# Altium project SAMD21_Xplained_Pro.PrjPCB (part 1 of 2)
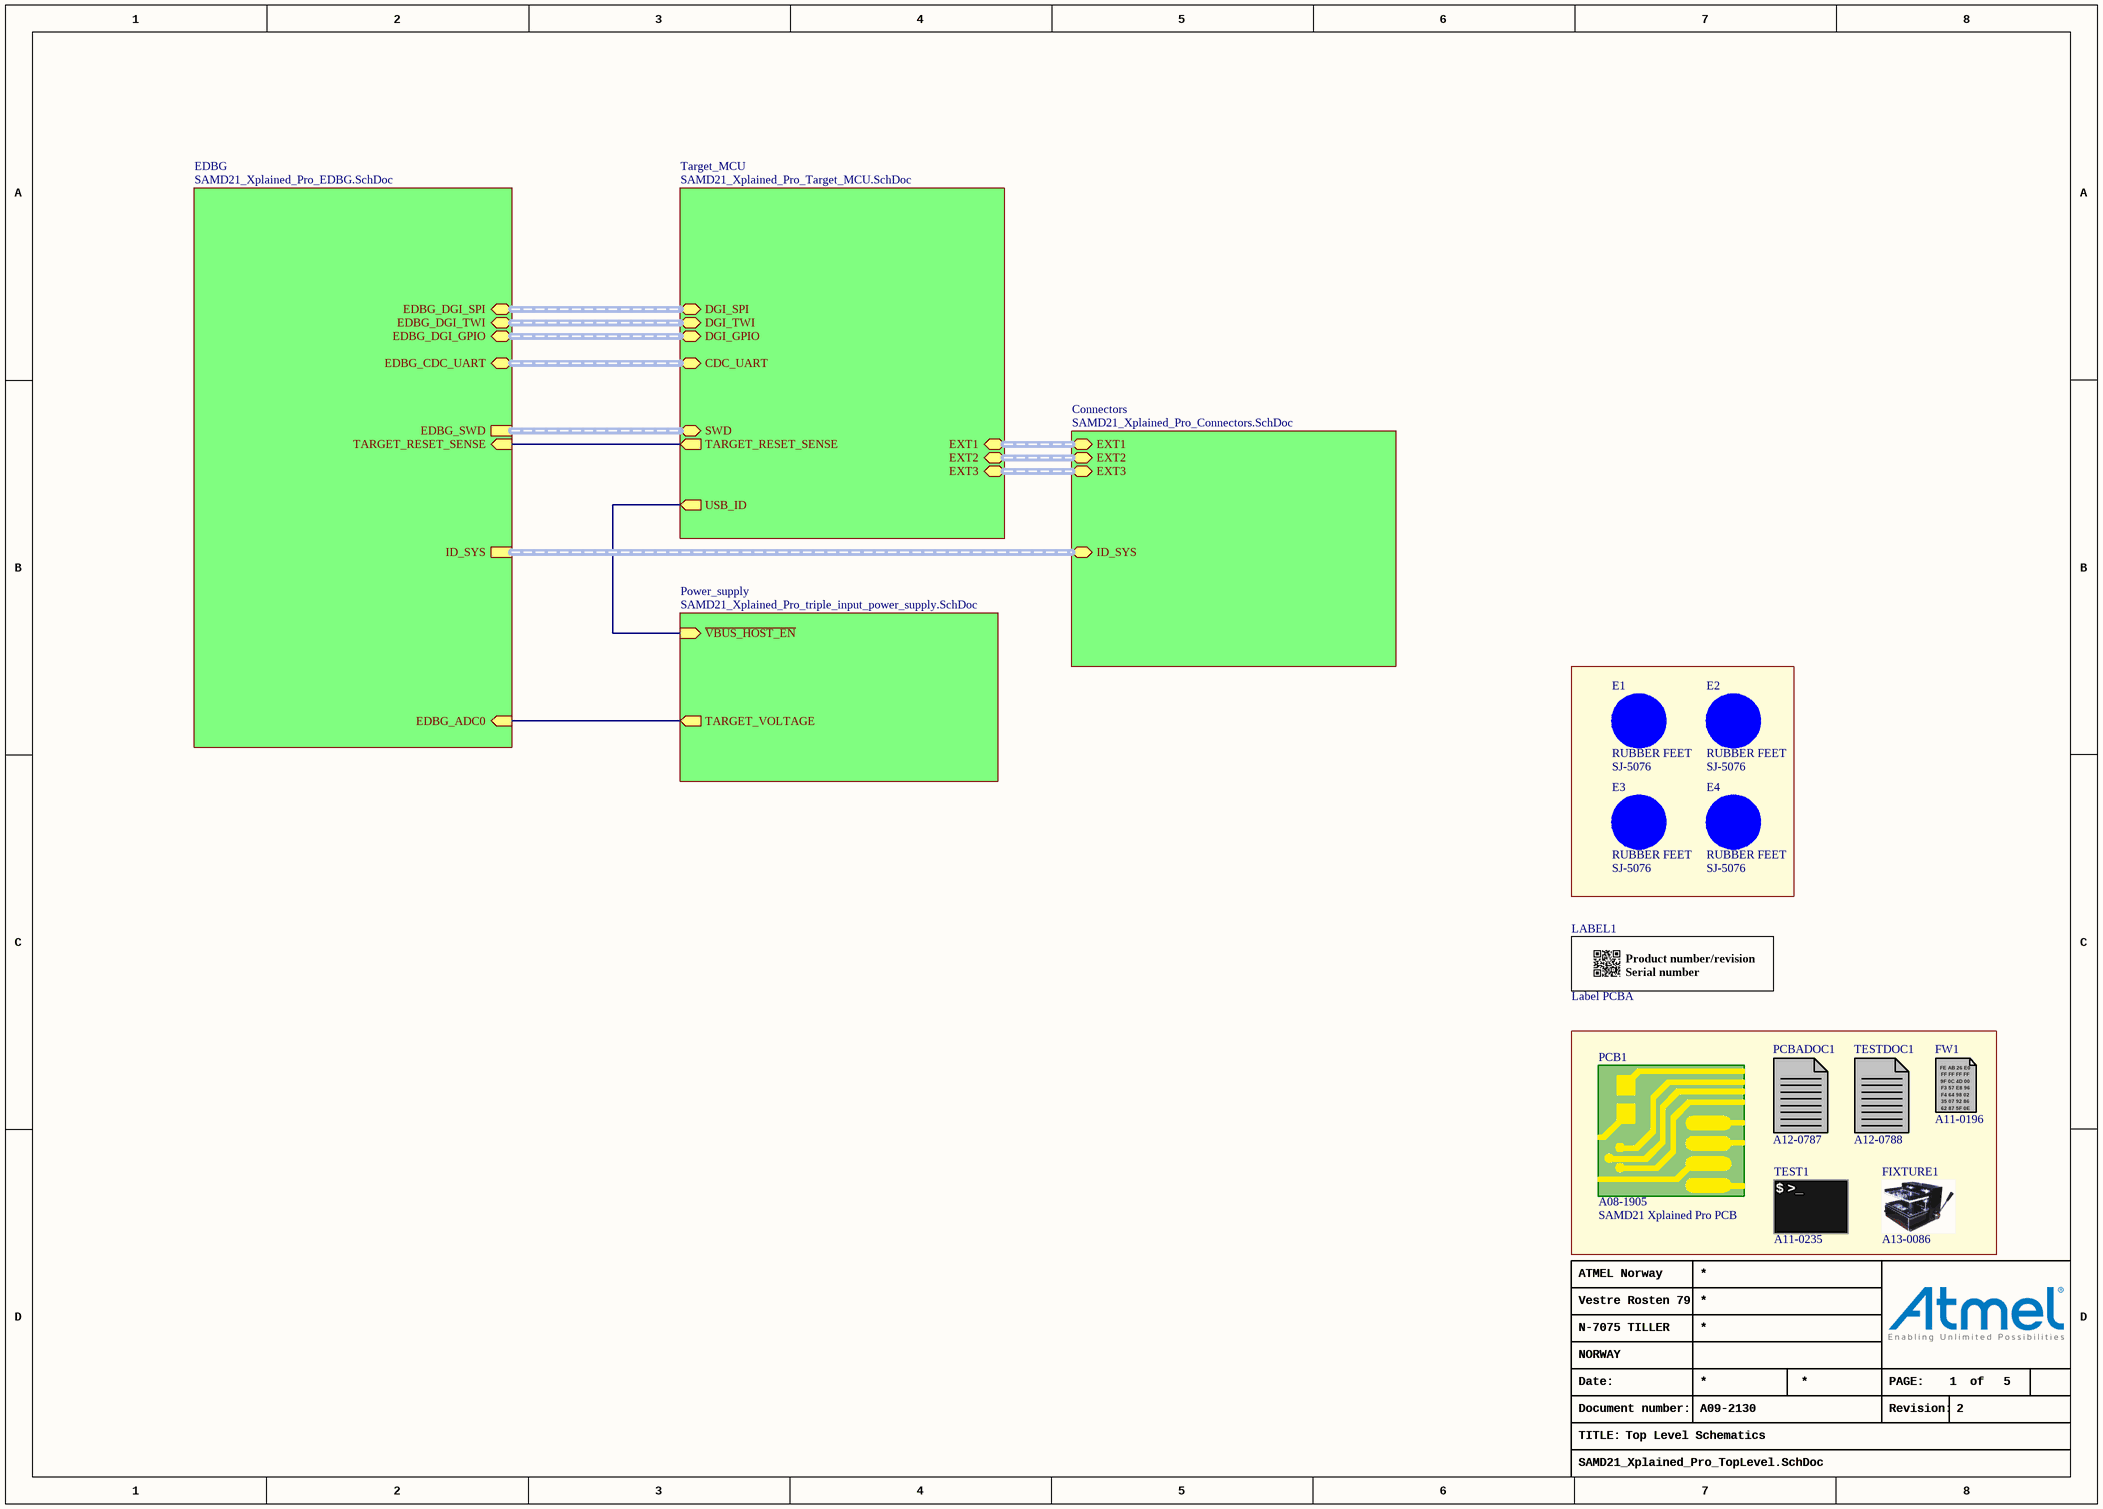
[diagram p0: SAMD21_Xplained_Pro_TopLevel.SchDoc]
5 sheets, 136 parts. Net scope: hierarchical (ports join the sheet entries above them; power ports are global).
Board file: SAMD21_Xplained_Pro.PcbDoc
Sheets:
  SAMD21_Xplained_Pro_TopLevel.SchDoc
    Target_MCU = SAMD21_Xplained_Pro_Target_MCU.SchDoc
    EDBG = SAMD21_Xplained_Pro_EDBG.SchDoc
    Connectors = SAMD21_Xplained_Pro_Connectors.SchDoc
    Power_supply = SAMD21_Xplained_Pro_triple_input_power_supply.SchDoc

## Sheet SAMD21_Xplained_Pro_TopLevel.SchDoc: Top Level Schematics
size A3; Organization: ATMEL Norway; Address1: Vestre Rosten 79; Address2: N-7075 TILLER; Address3: NORWAY; DocumentNumber: A09-2130; Revision: 2; SheetNumber: 1; SheetTotal: 5; PageSetup: Record=PageOptions|CenterHorizontal=True|CenterVertical=True|PrintScale=1.01|XCorrection=1.00|YCorrection=1.00|PrintKind=1|BorderSize=5000000|LeftOffset=0|BottomOffset=0|Orientation=2|PaperLength=1000|PaperWidth=1000|Scale=100|PaperSource=7|PrintQuality=-4|MediaType=1|DitherType=10|PaperKind=Letter|PrintScaleMode=1

### Parts
E1  RUBBER FEET  value SJ-5076  [AP8-00192]
E2  RUBBER FEET  value SJ-5076  [AP8-00192]
E3  RUBBER FEET  value SJ-5076  [AP8-00192]
E4  RUBBER FEET  value SJ-5076  [AP8-00192]
FIXTURE1  AN: A13-0086  (hidden comment: JIG)  (mechanical)
FW1  AN: A11-0196  (hidden comment: FW)  (mechanical)
LABEL1  value Label PCBA  [AP8-00317]  (hidden comment: PCBA_LABEL)
PCB1  value SAMD21 Xplained Pro PCB  AN: A08-1905  (hidden comment: PCB)  (mechanical)
PCBADOC1  AN: A12-0787  (hidden comment: PCBADOC)  (mechanical)
TEST1  AN: A11-0235  (hidden comment: TEST)  (mechanical)
TESTDOC1  AN: A12-0788  (hidden comment: TESTDOC)  (mechanical)

### Sub-sheets
Connectors = SAMD21_Xplained_Pro_Connectors.SchDoc: ID_SYS (harness ID_SYS), EXT1 (harness EXT), EXT3 (harness EXT), EXT2 (harness EXT)
EDBG = SAMD21_Xplained_Pro_EDBG.SchDoc: ID_SYS (harness ID_SYS), EDBG_SWD (harness SWD), EDBG_CDC_UART (harness CDC_UART), EDBG_DGI_TWI (harness DGI_TWI), EDBG_DGI_SPI (harness DGI_SPI), EDBG_DGI_GPIO (harness DGI_GPIO), TARGET_RESET_SENSE (in), EDBG_ADC0 (in)
Power_supply = SAMD21_Xplained_Pro_triple_input_power_supply.SchDoc: TARGET_VOLTAGE (out), ~{VBUS_HOST_EN} (in)
Target_MCU = SAMD21_Xplained_Pro_Target_MCU.SchDoc: SWD (harness SWD), DGI_SPI (harness DGI_SPI), DGI_TWI (harness DGI_TWI), DGI_GPIO (harness DGI_GPIO), CDC_UART (harness CDC_UART), TARGET_RESET_SENSE (out), EXT2 (harness EXT), EXT3 (harness EXT), EXT1 (harness EXT), USB_ID (out)

### Nets
EDBG_ADC0: sheet EDBG/EDBG_ADC0, sheet Power_supply/TARGET_VOLTAGE
TARGET_RESET_SENSE: sheet Target_MCU/TARGET_RESET_SENSE, sheet EDBG/TARGET_RESET_SENSE
TARGET_USB_ID: sheet Target_MCU/USB_ID, sheet Power_supply/~{VBUS_HOST_EN}

Not connected (* = marked no-connect by the designer): E1 1(FIDUCIAL); E2 1(FIDUCIAL); E3 1(FIDUCIAL); E4 1(FIDUCIAL)

### Buses and harness runs
harness sheet Connectors/EXT1 = sheet Target_MCU/EXT1
harness sheet Connectors/EXT2 = sheet Target_MCU/EXT2
harness sheet Connectors/EXT3 = sheet Target_MCU/EXT3
harness sheet Connectors/ID_SYS = sheet EDBG/ID_SYS
harness sheet EDBG/EDBG_CDC_UART = sheet Target_MCU/CDC_UART
harness sheet EDBG/EDBG_DGI_GPIO = sheet Target_MCU/DGI_GPIO
harness sheet EDBG/EDBG_DGI_SPI = sheet Target_MCU/DGI_SPI
harness sheet EDBG/EDBG_DGI_TWI = sheet Target_MCU/DGI_TWI
harness sheet EDBG/EDBG_SWD = sheet Target_MCU/SWD

### Notes on the sheet
- Date:
- PAGE:
- of
- TITLE:
- Document number:
- Revision:
- (in symbol A09-0611) / Product number/revision / Serial number
- (in symbol A11-0196) FE AB 26 E0; FF FF FF FF; 9F 0C 4D 00; F3 57 E8 96; F4 64 98 02; 35 07 92 86; 62 87 5F 0E
- (in symbol A11-0235) $ >_

### Library data of the parts
E1-E4 = A08-0053: 2.8mm adhesive feet,diam 8.0mm; PartGroup: Mechanical devices,Mounting accessories; Manufacturer: 3M; AN: A08-0053; Height: 2,79999995231628; MPN: SJ-5076
FIXTURE1 = A13-0086: Xplained PRO MCU board Jupiter Test Fixture; PartGroup: Test Equipment,Test Fixtures; Manufacturer: ESCATEC; Value: Xplained PRO MCU board Jupiter Test Fixture; MPN: Xplained PRO MCU board Jupiter Test Fixture
FW1 = A11-0196: EDBG secured firmware; PartGroup: Software,Firmware,Tools; Manufacturer: ATMEL; Value: EDBG secured firmware
LABEL1 = A09-0611: PCBA identification label PP Top White Gloss; PartGroup: Mechanical devices,Packaging materials,Printed Labels; Manufacturer: ACT Logimark AS; MPN: 505462; AN: A09-0611
PCB1 = A08-1905: SAMD21 Xplained Pro PCB, 4 layer, 60mm x 100mm; PartGroup: Mechanical devices,Printed circuit boards
PCBADOC1 = A12-0787: SAMD21 Xplained Pro PCBA documentation; PartGroup: Documentation,PCBA Documents,Atmel; Manufacturer: ATMEL; Value: A09-2130 PCBA Files
TEST1 = A11-0235: Fixture eggTest for SAMD21 Xplained Pro; PartGroup: Software,Test software,Starter Kit; Manufacturer: ATMEL; Value: SAMD21 Xplained Pro test
TESTDOC1 = A12-0788: SAMD21 Xplained Pro Test Instructions; PartGroup: Documentation,Procedures,Test Instructions; Manufacturer: ATMEL; Value: SAMD21 Xplained Pro Test Instructions

## Sheet SAMD21_Xplained_Pro_Target_MCU.SchDoc: Target MCU
size A3; Organization: ATMEL Norway; Address1: Vestre Rosten 79; Address2: N-7075 TILLER; Address3: NORWAY; DocumentNumber: A09-2130; Revision: 2; SheetNumber: 4; SheetTotal: 5; PageSetup: Record=PageOptions|CenterHorizontal=True|CenterVertical=True|PrintScale=1.01|XCorrection=1.00|YCorrection=1.00|PrintKind=1|BorderSize=5000000|LeftOffset=0|BottomOffset=0|Orientation=2|PaperLength=1000|PaperWidth=1000|Scale=100|PaperSource=7|PrintQuality=-4|MediaType=1|DitherType=10|PaperKind=A3 (297 x 420 mm)|PrintScaleMode=1
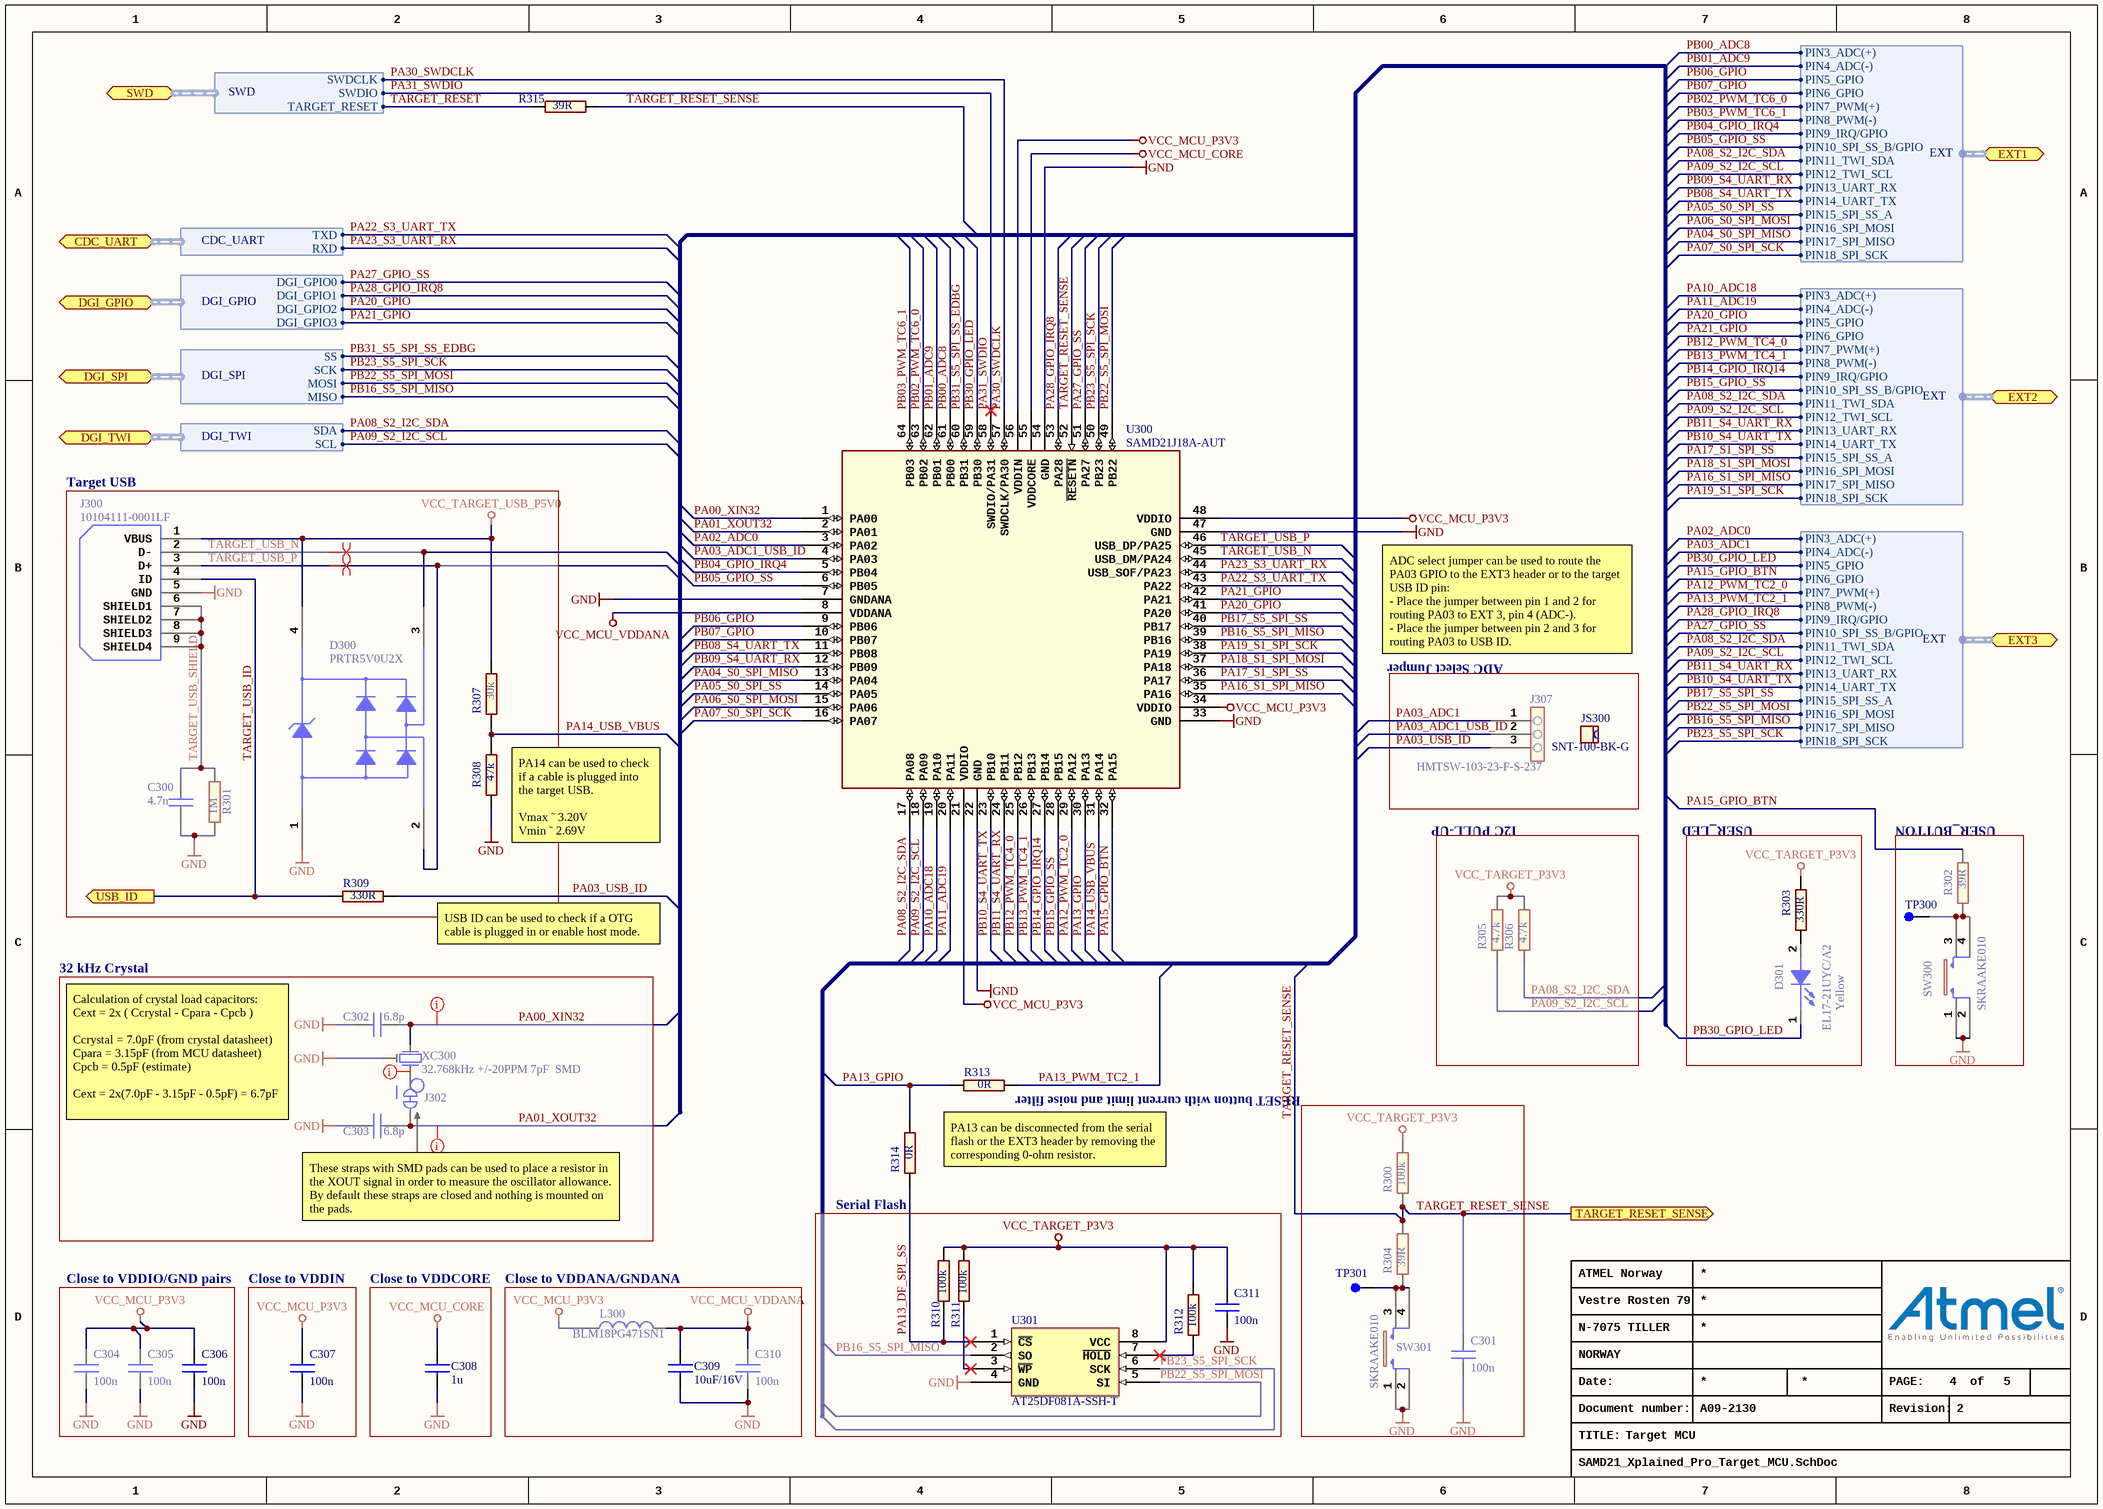
[diagram p1: SAMD21_Xplained_Pro_Target_MCU.SchDoc]

### Parts
C300  value 4.7n  [AP1-00053]  (hidden comment: CAP-NONPOL)
C301  100n  [AP1-00053]
C302  value 6.8p  [AP1-00001]  (hidden comment: CAP-NONPOL)
C303  value 6.8p  [AP1-00001]  (hidden comment: CAP-NONPOL)
C304  value 100n  [AP1-00001]  (hidden comment: CAP-NONPOL)
C305  value 100n  [AP1-00001]  (hidden comment: CAP-NONPOL)
C306  value 100n  [AP1-00001]  (hidden comment: CAP-NONPOL)
C307  value 100n  [AP1-00001]  (hidden comment: CAP-NONPOL)
C308  value 1u  [AP1-00001]  (hidden comment: CAP-NONPOL)
C309  value 10uF/16V  [AP1-00039]  (hidden comment: CAP-NONPOL)
C310  value 100n  [AP1-00001]  (hidden comment: CAP-NONPOL)
C311  100n  [AP1-00001]
D300  PRTR5V0U2X  [AP4-00001]
D301  Yellow  value EL17-21UYC/A2  [AP4-00013]
J300  value 10104111-0001LF  [AP8-00604]  (hidden comment: USB_AB)
J302  (no value)  [AP9-00044]  (net tie, no BOM)
J307  value HMTSW-103-23-F-S-237  [AP8-00745]  (hidden comment: Same as A08-1614 but with 1mm hole for optimal reflow soldering (no misalignment of the component))
JS300  value SNT-100-BK-G  [AP8-00525]
L300  BLM18PG471SN1  [AP3-00005]
R300  value 100k  [AP2-00011]  (hidden comment: R2)
R301  value 1M  [AP2-00011]  (hidden comment: R2)
R302  value 39R  [AP2-00011]  (hidden comment: R2)
R303  value 330R  [AP2-00000]  (hidden comment: R2)
R304  value 39R  [AP2-00011]  (hidden comment: R2)
R305  value 4.7k  [AP2-00000]  (hidden comment: R2)
R306  value 4.7k  [AP2-00000]  (hidden comment: R2)
R307  value 30k  [AP2-00000]  (hidden comment: R2)
R308  value 47k  [AP2-00000]  (hidden comment: R2)
R309  value 330R  [AP2-00000]  (hidden comment: R2)
R310  value 100k  [AP2-00000]  (hidden comment: R2)
R311  value 100k  [AP2-00000]  (hidden comment: R2)
R312  value 100k  [AP2-00000]  (hidden comment: R2)
R313  value 0R  [AP2-00000]  (hidden comment: R2)
R314  value 0R  [AP2-00000]  (hidden comment: R2)
R315  value 39R  [AP2-00011]  (hidden comment: R2)
SW300  value SKRAAKE010  [AP8-00137]  (hidden comment: Can be ordered in low volumes from Mouser)
SW301  value SKRAAKE010  [AP8-00137]  (hidden comment: Can be ordered in low volumes from Mouser)
TP300  TESTPOINT  [AP8-00010]  (value not drawn)  (no BOM)
TP301  TESTPOINT  [AP8-00010]  (value not drawn)  (no BOM)
U300  value SAMD21J18A-AUT  [AP6-00173]  (hidden comment: TQFP64)
U301  value AT25DF081A-SSH-T  [AP8-00417]  (hidden comment: AT25DF081A)
XC300  value 32.768kHz +/-20PPM 7pF  SMD  [AP7-00044]  (hidden comment: Farnell order no:1539364)

### Blocks framed on the sheet
Target USB: C300 D300 J300 R301 R307-R309
ADC Select Jumper: J307 JS300
I2C PULL-UP: R305 R306
USER_LED: D301 R303
USER_BUTTON: R302 SW300 TP300
32 kHz Crystal: C302 C303 J302 XC300
RESET button with current limit and noise filter: C301 R300 R304 SW301 TP301
Serial Flash: C311 R310-R312 U301
Close to VDDIO/GND pairs: C304-C306
Close to VDDIN: C307
Close to VDDCORE: C308
Close to VDDANA/GNDANA: C309 C310 L300

### Ports
CDC_UART (harness CDC_UART), DGI_GPIO (harness DGI_GPIO), DGI_SPI (harness DGI_SPI), DGI_TWI (harness DGI_TWI), EXT1 (harness EXT), EXT2 (harness EXT), EXT3 (harness EXT), SWD (harness SWD), TARGET_RESET_SENSE (out), USB_ID (out)

### Harnesses
SWD: SWDCLK, SWDIO, TARGET_RESET
DGI_GPIO: DGI_GPIO0, DGI_GPIO1, DGI_GPIO2, DGI_GPIO3
DGI_SPI: MISO, MOSI, SCK, SS
DGI_TWI: SCL, SDA
CDC_UART: RXD, TXD
EXT: PIN10_SPI_SS_B/GPIO, PIN11_TWI_SDA, PIN12_TWI_SCL, PIN13_UART_RX, PIN14_UART_TX, PIN15_SPI_SS_A, PIN16_SPI_MOSI, PIN17_SPI_MISO, PIN18_SPI_SCK, PIN3_ADC(+), PIN4_ADC(-), PIN5_GPIO, PIN6_GPIO, PIN7_PWM(+), PIN8_PWM(-), PIN9_IRQ/GPIO

### Nets
GND: C300.1 C301.2 C302.2 C303.2 C304.2 C305.2 C306.2 C307.2 C308.2 C309.2 C310.2 C311.2 D300.1(GND) J300.5(GND) R301.1 R308.1 SW300.1 SW300.2 SW301.1 SW301.2 U300.7(GNDANA) U300.22(GND) U300.33(GND) U300.47(GND) U300.54(GND) U301.4(GND) XC300.3
VCC_MCU_CORE: C308.1 U300.55(VDDCORE)
VCC_MCU_P3V3: C304.1 C305.1 C306.1 C307.1 L300.1 U300.21(VDDIO) U300.34(VDDIO) U300.48(VDDIO) U300.56(VDDIN)
VCC_MCU_VDDANA: C309.1 C310.1 L300.2 U300.8(VDDANA)
VCC_TARGET_P3V3: C311.1 R300.2 R303.2 R305.2 R306.2 R310.1 R311.1 R312.2 U301.8(VCC)
VCC_TARGET_USB_P5V0: D300.4(VCC) J300.1(VBUS) R307.2
PA00_XIN32: C302.1 U300.1(PA00) XC300.2
PA01_XOUT32: C303.1 J302.2 U300.2(PA01)
PA02_ADC0: U300.3(PA02) ; port EXT3.PIN3_ADC(+)
PA03_ADC1: J307.1 ; port EXT3.PIN4_ADC(-)
PA03_ADC1_USB_ID: J307.2 U300.4(PA03)
PA03_USB_ID: J307.3 R309.2
PA04_S0_SPI_MISO: U300.13(PA04) ; port EXT1.PIN17_SPI_MISO
PA05_S0_SPI_SS: U300.14(PA05) ; port EXT1.PIN15_SPI_SS_A
PA06_S0_SPI_MOSI: U300.15(PA06) ; port EXT1.PIN16_SPI_MOSI
PA07_S0_SPI_SCK: U300.16(PA07) ; port EXT1.PIN18_SPI_SCK
PA08_S2_I2C_SDA: R306.1 U300.17(PA08) ; port DGI_TWI.SDA, port EXT1.PIN11_TWI_SDA, port EXT2.PIN11_TWI_SDA, port EXT3.PIN11_TWI_SDA  [project net EDBG_DGI_SDA]
PA09_S2_I2C_SCL: R305.1 U300.18(PA09) ; port DGI_TWI.SCL, port EXT1.PIN12_TWI_SCL, port EXT2.PIN12_TWI_SCL, port EXT3.PIN12_TWI_SCL  [project net EDBG_DGI_SCL]
PA10_ADC18: U300.19(PA10) ; port EXT2.PIN3_ADC(+)
PA11_ADC19: U300.20(PA11) ; port EXT2.PIN4_ADC(-)
PA12_PWM_TC2_0: U300.29(PA12) ; port EXT3.PIN7_PWM(+)
PA13_DF_SPI_SS: R310.2 R314.1 U301.1(~{CS})
PA13_GPIO: R313.2 R314.2 U300.30(PA13)
PA13_PWM_TC2_1: R313.1 ; port EXT3.PIN8_PWM(-)
PA14_USB_VBUS: R307.1 R308.2 U300.31(PA14)
PA15_GPIO_BTN: R302.2 U300.32(PA15) ; port EXT3.PIN6_GPIO
PA16_S1_SPI_MISO: U300.35(PA16) ; port EXT2.PIN17_SPI_MISO
PA17_S1_SPI_SS: U300.36(PA17) ; port EXT2.PIN15_SPI_SS_A
PA18_S1_SPI_MOSI: U300.37(PA18) ; port EXT2.PIN16_SPI_MOSI
PA19_S1_SPI_SCK: U300.38(PA19) ; port EXT2.PIN18_SPI_SCK
PA20_GPIO: U300.41(PA20) ; port DGI_GPIO.DGI_GPIO2, port EXT2.PIN5_GPIO
PA21_GPIO: U300.42(PA21) ; port DGI_GPIO.DGI_GPIO3, port EXT2.PIN6_GPIO
PA22_S3_UART_TX: U300.43(PA22) ; port CDC_UART.TXD  [project net EDBG_CDC_USART_RX]
PA23_S3_UART_RX: U300.44(USB_SOF/PA23) ; port CDC_UART.RXD
PA27_GPIO_SS: U300.51(PA27) ; port DGI_GPIO.DGI_GPIO0, port EXT3.PIN10_SPI_SS_B/GPIO
PA28_GPIO_IRQ8: U300.53(PA28) ; port DGI_GPIO.DGI_GPIO1, port EXT3.PIN9_IRQ/GPIO
PA30_SWDCLK: U300.57(SWDCLK/PA30) ; port SWD.SWDCLK
PA31_SWDIO: U300.58(SWDIO/PA31) ; port SWD.SWDIO
PB00_ADC8: U300.61(PB00) ; port EXT1.PIN3_ADC(+)
PB01_ADC9: U300.62(PB01) ; port EXT1.PIN4_ADC(-)
PB02_PWM_TC6_0: U300.63(PB02) ; port EXT1.PIN7_PWM(+)
PB03_PWM_TC6_1: U300.64(PB03) ; port EXT1.PIN8_PWM(-)
PB04_GPIO_IRQ4: U300.5(PB04) ; port EXT1.PIN9_IRQ/GPIO
PB05_GPIO_SS: U300.6(PB05) ; port EXT1.PIN10_SPI_SS_B/GPIO
PB06_GPIO: U300.9(PB06) ; port EXT1.PIN5_GPIO
PB07_GPIO: U300.10(PB07) ; port EXT1.PIN6_GPIO
PB08_S4_UART_TX: U300.11(PB08) ; port EXT1.PIN14_UART_TX
PB09_S4_UART_RX: U300.12(PB09) ; port EXT1.PIN13_UART_RX
PB10_S4_UART_TX: U300.23(PB10) ; port EXT2.PIN14_UART_TX, port EXT3.PIN14_UART_TX
PB11_S4_UART_RX: U300.24(PB11) ; port EXT2.PIN13_UART_RX, port EXT3.PIN13_UART_RX
PB12_PWM_TC4_0: U300.25(PB12) ; port EXT2.PIN7_PWM(+)
PB13_PWM_TC4_1: U300.26(PB13) ; port EXT2.PIN8_PWM(-)
PB14_GPIO_IRQ14: U300.27(PB14) ; port EXT2.PIN9_IRQ/GPIO
PB15_GPIO_SS: U300.28(PB15) ; port EXT2.PIN10_SPI_SS_B/GPIO
PB16_S5_SPI_MISO: U300.39(PB16) U301.2(SO) ; port DGI_SPI.MISO, port EXT3.PIN17_SPI_MISO
PB17_S5_SPI_SS: U300.40(PB17) ; port EXT3.PIN15_SPI_SS_A
PB22_S5_SPI_MOSI: U300.49(PB22) U301.5(SI) ; port DGI_SPI.MOSI, port EXT3.PIN16_SPI_MOSI  [project net EDBG_SPI_DGI_MOSI]
PB23_S5_SPI_SCK: U300.50(PB23) U301.6(SCK) ; port DGI_SPI.SCK, port EXT3.PIN18_SPI_SCK  [project net EDBG_SPI_DGI_SCK]
PB30_GPIO_LED: D301.1(CATHODE) U300.59(PB30) ; port EXT3.PIN5_GPIO
PB31_S5_SPI_SS_EDBG: U300.60(PB31) ; port DGI_SPI.SS  [project net EDBG_SPI_DGI_SS]
TARGET_RESET: R315.1 ; port SWD.TARGET_RESET
TARGET_RESET_SENSE: C301.1 R300.1 R304.2 R315.2 U300.52(~{RESETN}) ; port TARGET_RESET_SENSE
TARGET_USB_ID: J300.4(ID) R309.1 ; port USB_ID
TARGET_USB_N: D300.3(I/O_2) J300.2(D-) U300.45(USB_DM/PA24)
TARGET_USB_P: D300.2(I/O_1) J300.3(D+) U300.46(USB_DP/PA25)
TARGET_USB_SHIELD: C300.2 J300.6(SHIELD1) J300.7(SHIELD2) J300.8(SHIELD3) J300.9(SHIELD4) R301.2
NetD301_2: D301.2(ANODE) R303.1
NetJ302_1: J302.1 XC300.1
NetR302_1: R302.1 SW300.3 SW300.4 TP300.1
NetR304_1: R304.1 SW301.3 SW301.4 TP301.1
NetR311_2: R311.2 U301.3(~{WP})
NetR312_1: R312.1 U301.7(~{HOLD})

### Layout directives
rule Assembly Testpoint Usage [Testpoint - Not Allowed    Multiple - Not Allowed]: NetJ302_1, PA00_XIN32, PA01_XOUT32
differential pair; rule Assembly Testpoint Usage [Testpoint - Not Allowed    Multiple - Not Allowed]: TARGET_USB_N, TARGET_USB_P

### Notes on the sheet
- ADC select jumper can be used to route the PA03 GPIO to the EXT3 header or to the target USB ID pin:
  - Place the jumper between pin 1 and 2 for routing PA03 to EXT 3, pin 4 (ADC-).
  - Place the jumper between pin 2 and 3 for routing PA03 to USB ID.
- (near R308) PA14 can be used to check
  if a cable is plugged into
  the target USB.
  Vmax ˜ 3.20V
  Vmin ˜ 2.69V
- USB ID can be used to check if a OTG cable is plugged in or enable host mode.
- Calculation of crystal load capacitors:
  Cext = 2x ( Ccrystal - Cpara - Cpcb )
  Ccrystal = 7.0pF (from crystal datasheet)
  Cpara = 3.15pF (from MCU datasheet)
  Cpcb = 0.5pF (estimate)
  Cext = 2x(7.0pF - 3.15pF - 0.5pF) = 6.7pF
- PA13 can be disconnected from the serial flash or the EXT3 header by removing the corresponding 0-ohm resistor.
- These straps with SMD pads can be used to place a resistor in the XOUT signal in order to measure the oscillator allowance.
  By default these straps are closed and nothing is mounted on the pads.
- Date:
- PAGE:
- of
- TITLE:
- Document number:
- Revision:

### Library data of the parts
C300 = A01-0046: Ceramic capacitor, SMD 0402, X7R, 25V, +/-10%; PartGroup: Capacitors,Ceramic,SMD 0402; TemperatureRange: -55 - +125 deg C; AN: A01-0046; Tolerance: 25V, +/-10%; Height: 0.550000011920929
C301 C304-C307 C310 C311 = A01-0246: Ceramic capacitor, SMD 0402, X7R, 16V, +/-10%; PartGroup: Capacitors,Ceramic,SMD 0402; Manufacturer: Kemet; MPN: C0402C104K4RACTU; TemperatureRange: -55 - +125 deg C; AN: A01-0246; Tolerance: 16V, +/-10%; Height: 0,5
  C301 C311: Value: 100n
C302 C303 = A01-0013: Ceramic capacitor, SMD 0402, NP0, 50V, +/-5%; PartGroup: Capacitors,Ceramic,SMD 0402; TemperatureRange: -55 - +125 deg C; AN: A01-0013; Tolerance: 50V, +/-5%; Height: 0,550000011920929
C308 = A01-0286: Ceramic capacitor, SMD 0402, X5R, 6.3V, +/-10% (de26942); PartGroup: Capacitors,Ceramic,SMD 0402; Manufacturer: Kemet; MPN: C0402C105K9PAC; TemperatureRange: -55 to 85 deg C; AN: A01-0286; Tolerance: +/-10%; Height: 0,5
C309 = A01-0491: Ceramic capacitor, SMD 0603, X5R, 16V, 10UF ± 20% (High Density); PartGroup: Capacitors,Ceramic,SMD 0603; Manufacturer: Taiyo Yuden; MPN: EMK107BBJ106MA-T; AN: A01-0491
D300 = A06-0236: Double rail-to-rail USB ESD protection diode; OrcadPartType: Integrated Circuits&Special function&Protection; Manufacturer: Philips; TemperatureRange: -40 to +85 C; AN: A06-0236; Value: PRTR5V0U2X; PartType: Buy; Height: 1,10000002384186; MPN: PRTR5V0U2X
D301 = A10-0019: LED, Yellow, Wave length=591nm, SMD 0805, ±70°; PartGroup: Opto,LEDs,SMD; Manufacturer: Everlight; MPN: 17-21UYC/S530-A3/TR8; TemperatureRange: -40 to +85 deg C; AN: A10-0019; Height: 1,10000002384186
J300 = A08-1368: Micro USB AB Connector; PartGroup: Mechanical devices,Connectors,USB; Manufacturer: FCI; AN: A08-1368; Height: 2.59999990463257; MPN: 10104111-0001LF
J302 = A09-0783: Default closed SMD strap, 0603 size; PartGroup: Mechanical devices,PCB implemented components; Value: SMD-STRAP_0603_CLOSED; AN: A09-0783; Height: 0
J307 = A08-1799: 1x3 pin header, 2.54mm pitch, Pin-in-Paste THM, 1mm hole; PartGroup: Mechanical devices,Connectors,Pin headers; Manufacturer: SAMTEC; AN: A08-1799; Height: 6,09999990463257; MPN: HMTSW-103-23-F-S-237
JS300 = A08-0543: Jumper cap for 2.54mm pinheader; PartGroup: Mechanical devices,Mounting accessories,Other; Manufacturer: SAMTEC; AN: A08-0543; MPN: SNT-100-BK-G
L300 = A03-0035: SMD RF inductor 0603. Z=470Ohm (@100MHz), Max R(dc)=0.65Ohm, Max current=1A; PartGroup: Inductors,EMI; Manufacturer: Murata; Tolerance: ±25%; TemperatureRange: -55°C to +125°C; AN: A03-0035; Value: BLM18PG471SN1; Height: 0,800000011920929; MPN: BLM18PG471SN1
R300 R310-R312 = A02-0260: Thick film resistor, SMD 0402, 1/16W, 1%; PartGroup: Resistors,SMD,0402 1%; TemperatureRange: -55 - +125 deg C; AN: A02-0260; Tolerance: 1 %; Height: 0,349999994039536
R301 = A02-0284: Thick film resistor, SMD 0402, 1/16W, 1%; PartGroup: Resistors,SMD,0402 1%; Manufacturer: KOA; MPN: RK73H1ETTP1004F; TemperatureRange: -55 - +125 deg C; AN: A02-0284; Tolerance: 1 %; Height: 0,349999994039536
R302 R304 R315 = A02-0178: Thick film resistor, SMD 0402, 1/16W, 1%; PartGroup: Resistors,SMD,0402 1%; TemperatureRange: -55 - +125 deg C; AN: A02-0178; Tolerance: 1 %; Height: 0,349999994039536
R303 R309 = A02-0200: Thick film resistor, SMD 0402, 1/16W, 1%; PartGroup: Resistors,SMD,0402 1%; TemperatureRange: -55 - +125 deg C; AN: A02-0200; Tolerance: 1 %; Height: 0.349999994039536
R305 R306 = A02-0228: Thick film resistor, SMD 0402, 1/16W, 1%; PartGroup: Resistors,SMD,0402 1%; TemperatureRange: -55 - +125 deg C; AN: A02-0228; Tolerance: 1 %; Height: 0.349999994039536
R307 = A02-0247: Thick film resistor, SMD 0402, 1/16W, 1%; PartGroup: Resistors,SMD,0402 1%; TemperatureRange: -55 - +125 deg C; AN: A02-0247; Tolerance: 1 %; Height: 0.349999994039536
R308 = A02-0252: Thick film resistor, SMD 0402, 1/16W, 1%; PartGroup: Resistors,SMD,0402 1%; TemperatureRange: -55 - +125 deg C; AN: A02-0252; Tolerance: 1 %; Height: 0.349999994039536
R313 R314 = A02-0163: RES 0.0 OHM 1/16W 0402 SMD; PartGroup: Resistors,SMD,0402 1%; MPN: RMCF0402ZT0R00; Tolerance: 1 %; TemperatureRange: -55 - +125 deg C; AN: A02-0163; Height: 0.349999994039536
SW300 SW301 = A08-0790: 6.2x6.2 mm SMD tact switch, same as A08-0091 but less force is needed; PartGroup: Mechanical devices,Switches,SMD; Manufacturer: ALPS; TemperatureRange: -30 - +90 deg C; AN: A08-0790; Height: 5,09999990463257; MPN: SKRAAKE010
TP300 TP301 = A08-0004: Single SMD testpad; PartGroup: Mechanical devices,Connectors,Test points; AN: A08-0004; Value: TESTPAD; Height: 0
U300 = A06-1041: Atmel 32-bit RISC MCU 64pin; PartGroup: Integrated Circuits,MCU, MPU, DSP,ARM MCU; TemperatureRange: -40°C to +85°C; Design comment: *; AN: A06-1041; Height: 1.20000004768372; Manufacturer: ATMEL; MPN: SAMD21J18A-AUT
U301 = A06-1051: 8Mbit SPI serial flash memory; PartGroup: Integrated Circuits,Memory,FLASH; Manufacturer: Adesto Technologies; TemperatureRange: -40°C to +85°C; AN: A06-1051; Height: 1.75; MPN: AT25DF081A-SSH-T
XC300 = A07-0052: 32k768 crystal, +-20ppm, CL=7pF, max ESR 60kOhm, SMD; PartGroup: Frequency devices,Crystals,SMD; Manufacturer: Micro Crystal; MPN: MS1V-T1K 32.768kHz 7pF +/-20PPM TA; Tolerance: +/- 20 PPM; TemperatureRange: -40 /+85; AN: A07-0052; Height: 2.07999992370605

## Sheet SAMD21_Xplained_Pro_EDBG.SchDoc: Embedded Debugger (EDBG)
size A3; Organization: ATMEL Norway; Address1: Vestre Rosten 79; Address2: N-7075 TILLER; Address3: NORWAY; DocumentNumber: A09-2130; Revision: 2; SheetNumber: 5; SheetTotal: 5; PageSetup: Record=PageOptions|CenterHorizontal=True|CenterVertical=True|PrintScale=0.73|XCorrection=1.00|YCorrection=1.00|PrintKind=1|BorderSize=5000000|LeftOffset=0|BottomOffset=0|Orientation=2|PaperLength=1000|PaperWidth=1000|Scale=100|PaperSource=7|PrintQuality=-4|MediaType=1|DitherType=10|PaperKind=A3 (297 x 420 mm)|PrintScaleMode=1
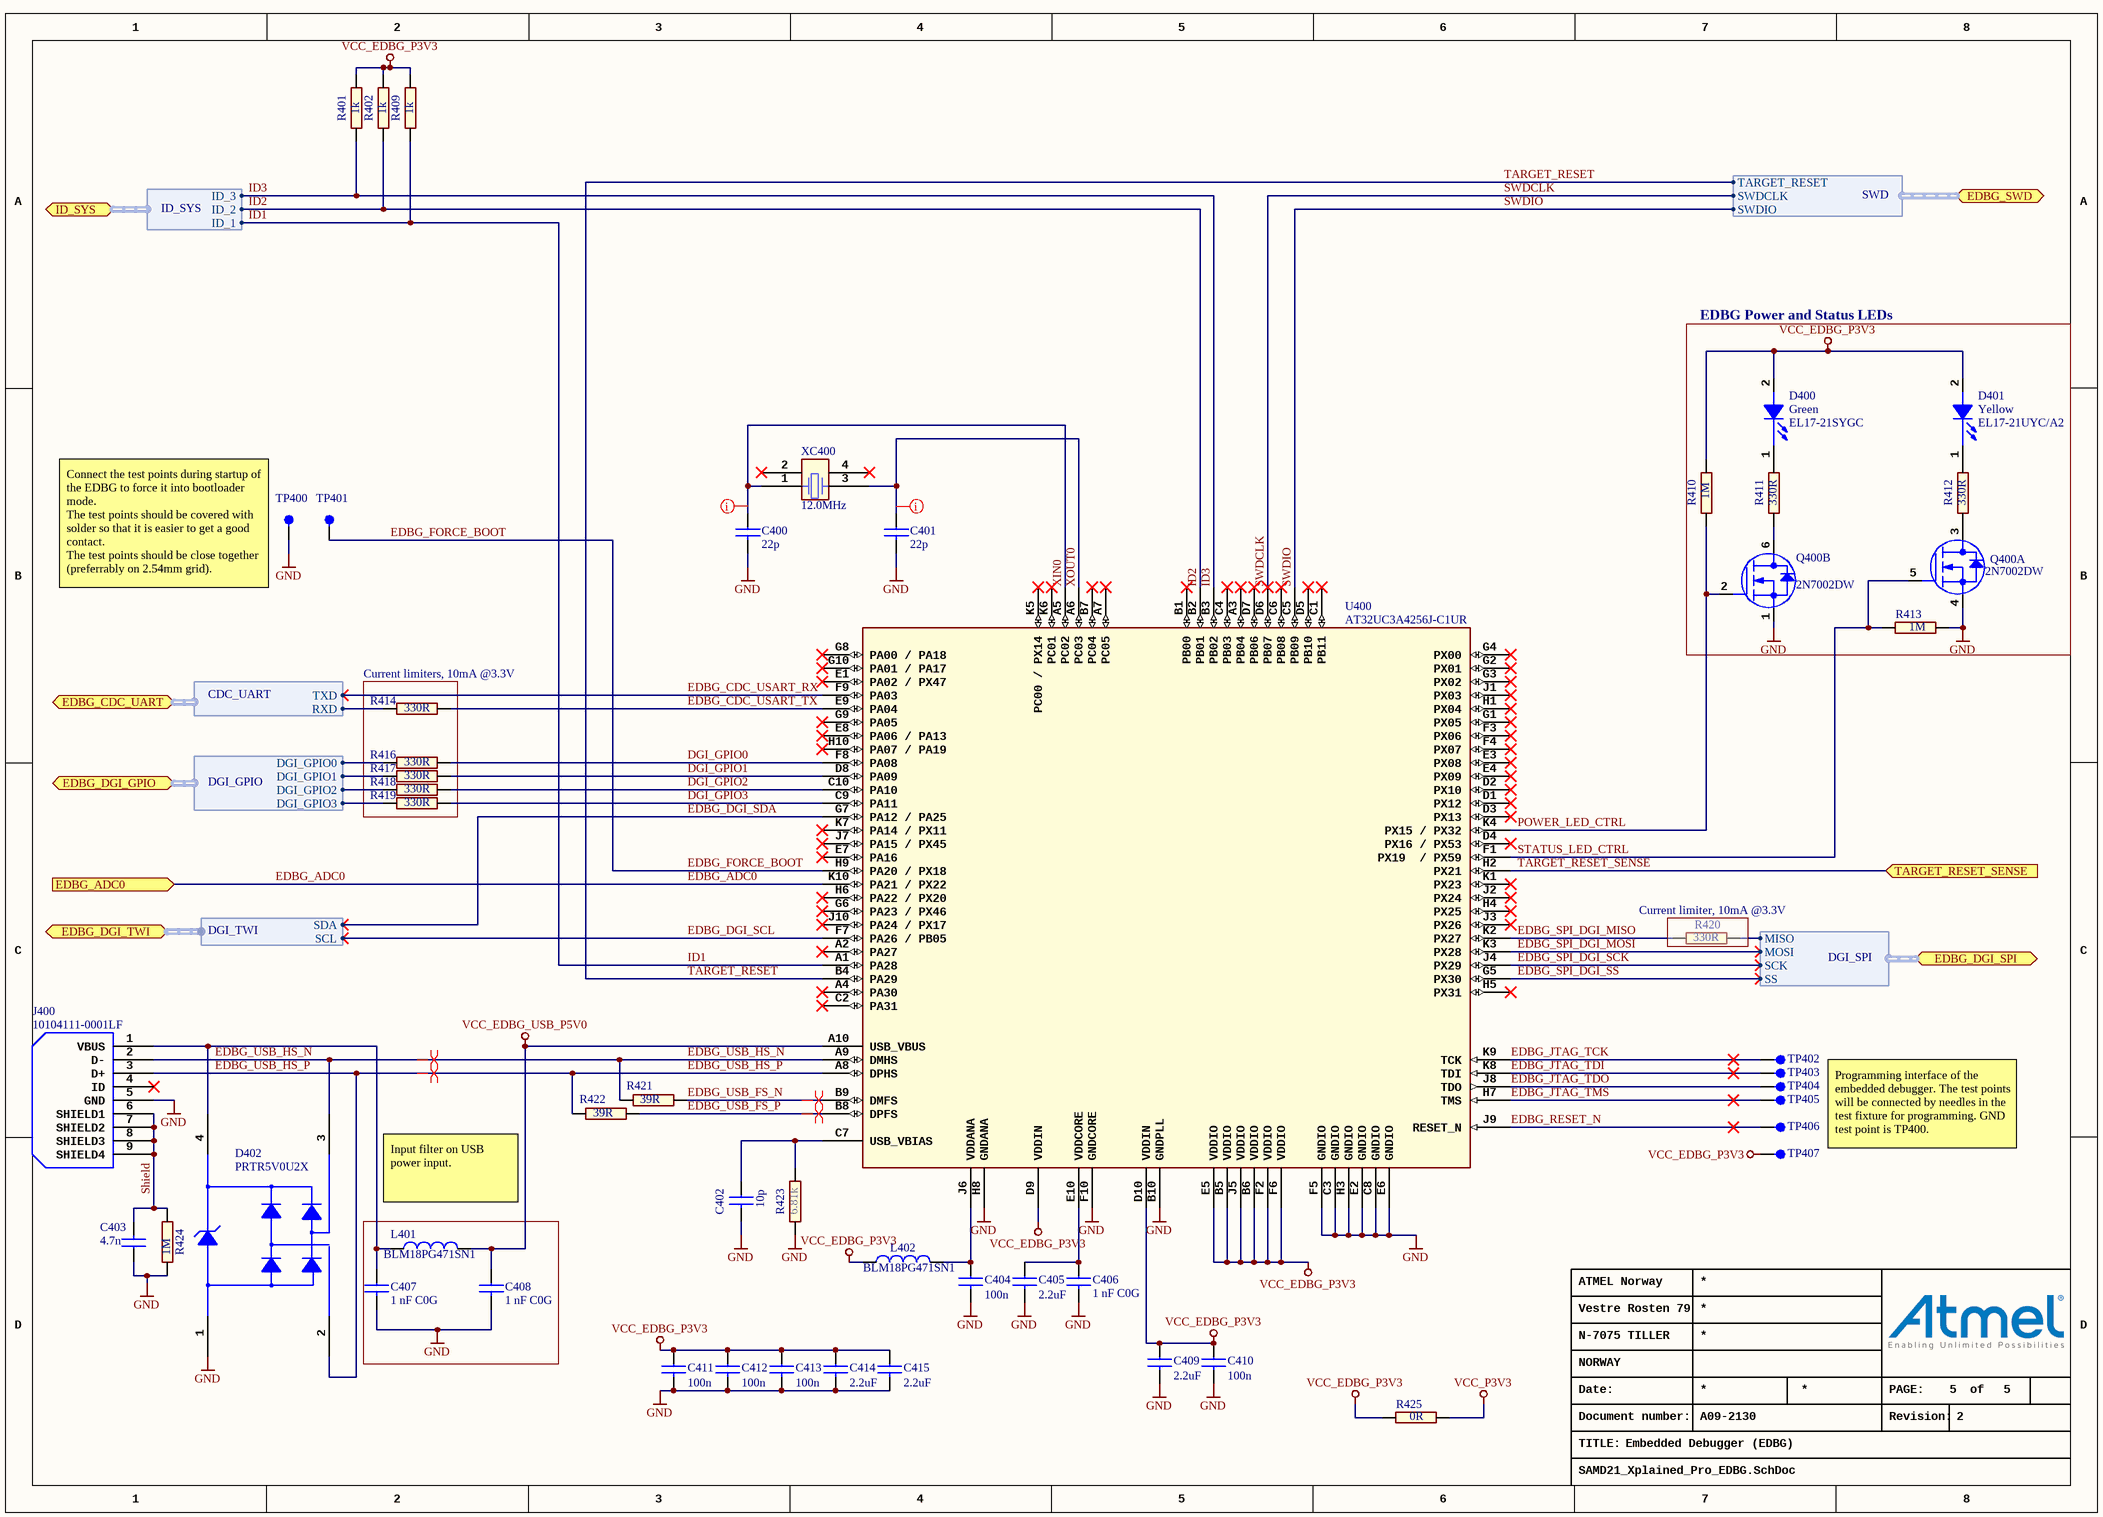
[diagram p2: SAMD21_Xplained_Pro_EDBG.SchDoc]

### Parts
C400  22p  [AP1-00053]
C401  22p  [AP1-00053]
C402  10p  [AP1-00053]
C403  value 4.7n  [AP1-00053]  (hidden comment: CAP-NONPOL)
C404  100n  [AP1-00053]
C405  value 2.2uF  [AP1-00053]  (hidden comment: Farnell no: 1288200)
C406  1 nF C0G  [AP1-00053]
C407  1 nF C0G  [AP1-00053]
C408  1 nF C0G  [AP1-00053]
C409  value 2.2uF  [AP1-00053]  (hidden comment: Farnell no: 1288200)
C410  100n  [AP1-00053]
C411  100n  [AP1-00053]
C412  100n  [AP1-00053]
C413  100n  [AP1-00053]
C414  value 2.2uF  [AP1-00053]  (hidden comment: Farnell no: 1288200)
C415  value 2.2uF  [AP1-00053]  (hidden comment: Farnell no: 1288200)
D400  Green  value EL17-21SYGC  [AP4-00013]
D401  Yellow  value EL17-21UYC/A2  [AP4-00013]
D402  PRTR5V0U2X  [AP4-00001]
J400  value 10104111-0001LF  [AP8-00604]  (hidden comment: USB_AB)
L401  BLM18PG471SN1  [AP3-00005]
L402  BLM18PG471SN1  [AP3-00005]
Q400  value 2N7002DW  [AP5-00001]  (hidden comment: Same as 2N7002 but with two MOSFETs in one package)  (parts A,B of 2)
R401  value 1k  [AP2-00000]  (hidden comment: R2)
R402  value 1k  [AP2-00000]  (hidden comment: R2)
R409  value 1k  [AP2-00000]  (hidden comment: R2)
R410  value 1M  [AP2-00000]  (hidden comment: R2)
R411  value 330R  [AP2-00000]  (hidden comment: R2)
R412  value 330R  [AP2-00000]  (hidden comment: R2)
R413  value 1M  [AP2-00000]  (hidden comment: R2)
R414  value 330R  [AP2-00000]  (hidden comment: R2)
R416  value 330R  [AP2-00000]  (hidden comment: R2)
R417  value 330R  [AP2-00000]  (hidden comment: R2)
R418  value 330R  [AP2-00000]  (hidden comment: R2)
R419  value 330R  [AP2-00000]  (hidden comment: R2)
R420  value 330R  [AP2-00000]  (hidden comment: R2)
R421  value 39R  [AP2-00011]  (hidden comment: R2)
R422  value 39R  [AP2-00011]  (hidden comment: R2)
R423  value 6.81k  [AP2-00011]  (hidden comment: R2)
R424  value 1M  [AP2-00011]  (hidden comment: R2)
R425  value 0R  [AP2-00000]  (hidden comment: R2)
TP400  TESTPAD  [AP8-00010]  (value not drawn)  (no BOM)
TP401  TESTPAD  [AP8-00010]  (value not drawn)  (no BOM)
TP402  TESTPAD  [AP8-00010]  (value not drawn)  (no BOM)
TP403  TESTPAD  [AP8-00010]  (value not drawn)  (no BOM)
TP404  TESTPAD  [AP8-00010]  (value not drawn)  (no BOM)
TP405  TESTPAD  [AP8-00010]  (value not drawn)  (no BOM)
TP406  TESTPAD  [AP8-00010]  (value not drawn)  (no BOM)
TP407  TESTPAD  [AP8-00010]  (value not drawn)  (no BOM)
U400  value AT32UC3A4256J-C1UR  [AP6-00206]  (hidden comment: 100 ball VFBGA)
XC400  12.0MHz  [AP7-00039]

### Blocks framed on the sheet
EDBG Power and Status LEDs: D400 D401 Q400 R410-R413
Current limiters, 10mA @3.3V: R414 R416-R419

### Ports
EDBG_ADC0 (in), EDBG_CDC_UART (harness CDC_UART), EDBG_DGI_GPIO (harness DGI_GPIO), EDBG_DGI_SPI (harness DGI_SPI), EDBG_DGI_TWI (harness DGI_TWI), EDBG_SWD (harness SWD), ID_SYS (harness ID_SYS), TARGET_RESET_SENSE (in)

### Harnesses
CDC_UART: TXD, RXD
DGI_SPI: MISO, MOSI, SCK, SS
DGI_GPIO: DGI_GPIO0, DGI_GPIO1, DGI_GPIO2, DGI_GPIO3
ID_SYS: ID_1, ID_2, ID_3
SWD: SWDCLK, SWDIO, TARGET_RESET
DGI_TWI: SCL, SDA

### Nets
GND: C400.2 C401.2 C402.2 C403.1 C404.2 C405.2 C406.2 C407.2 C408.2 C409.2 C410.2 C411.2 C412.2 C413.2 C414.2 C415.2 D402.1(GND) J400.5(GND) Q400.1(S2) Q400.4(S1) R413.1 R423.1 R424.1 TP400.1 U400.B10(GNDPLL) U400.C3(GNDIO) U400.C8(GNDIO) U400.E2(GNDIO) U400.E6(GNDIO) U400.F5(GNDIO) U400.F10(GNDCORE) U400.H3(GNDIO) U400.H8(GNDANA)
VCC_EDBG_P3V3: C409.1 C410.1 C411.1 C412.1 C413.1 C414.1 C415.1 D400.2(ANODE) D401.2(ANODE) L402.1 R401.2 R402.2 R409.2 R410.2 R425.1 TP407.1 U400.B5(VDDIO) U400.B6(VDDIO) U400.D9(VDDIN) U400.D10(VDDIN) U400.E5(VDDIO) U400.F2(VDDIO) U400.F6(VDDIO) U400.J5(VDDIO)
VCC_EDBG_USB_P5V0: C408.1 L401.2 U400.A10(USB_VBUS)
VCC_P3V3: R425.2
DGI_GPIO0: R416.2 U400.F8(PA08)
DGI_GPIO1: R417.2 U400.D8(PA09)
DGI_GPIO2: R418.2 U400.C10(PA10)
DGI_GPIO3: R419.2 U400.C9(PA11)
EDBG_ADC0: U400.K10(PA21_/_PX22) ; port EDBG_ADC0
EDBG_CDC_USART_RX: U400.F9(PA03) ; port EDBG_CDC_UART.TXD
EDBG_CDC_USART_TX: R414.2 U400.E9(PA04)
EDBG_DGI_SCL: U400.F7(PA26_/_PB05) ; port EDBG_DGI_TWI.SCL
EDBG_DGI_SDA: U400.G7(PA12_/_PA25) ; port EDBG_DGI_TWI.SDA
EDBG_FORCE_BOOT: TP401.1 U400.H9(PA20_/_PX18)
EDBG_JTAG_TCK: TP402.1 U400.K9(TCK)
EDBG_JTAG_TDI: TP403.1 U400.K8(TDI)
EDBG_JTAG_TDO: TP404.1 U400.J8(TDO)
EDBG_JTAG_TMS: TP405.1 U400.H7(TMS)
EDBG_RESET_N: TP406.1 U400.J9(RESET_N)
EDBG_SPI_DGI_MISO: R420.1 U400.K2(PX27)
EDBG_SPI_DGI_MOSI: U400.K3(PX28) ; port EDBG_DGI_SPI.MOSI
EDBG_SPI_DGI_SCK: U400.J4(PX29) ; port EDBG_DGI_SPI.SCK
EDBG_SPI_DGI_SS: U400.G5(PX30) ; port EDBG_DGI_SPI.SS
EDBG_USB_FS_N: R421.2 U400.B9(DMFS)
EDBG_USB_FS_P: R422.2 U400.B8(DPFS)
EDBG_USB_HS_N: D402.3(I/O_2) J400.2(D-) R421.1 U400.A9(DMHS)
EDBG_USB_HS_P: D402.2(I/O_1) J400.3(D+) R422.1 U400.A8(DPHS)
ID1: R409.1 U400.A1(PA28) ; port ID_SYS.ID_1
ID2: R402.1 U400.B2(PB01) ; port ID_SYS.ID_2
ID3: R401.1 U400.B3(PB02) ; port ID_SYS.ID_3
PA20_GPIO: R418.1 ; port EDBG_DGI_GPIO.DGI_GPIO2
PA21_GPIO: R419.1 ; port EDBG_DGI_GPIO.DGI_GPIO3
PA23_S3_UART_RX: R414.1 ; port EDBG_CDC_UART.RXD
PA27_GPIO_SS: R416.1 ; port EDBG_DGI_GPIO.DGI_GPIO0
PA28_GPIO_IRQ8: R417.1 ; port EDBG_DGI_GPIO.DGI_GPIO1
PB16_S5_SPI_MISO: R420.2 ; port EDBG_DGI_SPI.MISO
POWER_LED_CTRL: Q400.2(G2) R410.1 U400.K4(PX15_/_PX32)
Shield: C403.2 J400.6(SHIELD1) J400.7(SHIELD2) J400.8(SHIELD3) J400.9(SHIELD4) R424.2
STATUS_LED_CTRL: Q400.5(G1) R413.2 U400.F1(PX19__/_PX59)
SWDCLK: U400.D6(PB07) ; port EDBG_SWD.SWDCLK  [project net PA30_SWDCLK]
SWDIO: U400.C5(PB09) ; port EDBG_SWD.SWDIO  [project net PA31_SWDIO]
TARGET_RESET: U400.B4(PA29) ; port EDBG_SWD.TARGET_RESET
TARGET_RESET_SENSE: U400.H2(PX21) ; port TARGET_RESET_SENSE
XIN0: C400.1 U400.A5(PC02) XC400.1
XOUT0: C401.1 U400.A6(PC03) XC400.3
NetC402_1: C402.1 R423.2 U400.C7(USB_VBIAS)
NetC404_1: C404.1 L402.2 U400.J6(VDDANA)
NetC405_1: C405.1 C406.1 U400.E10(VDDCORE)
NetC407_1: C407.1 D402.4(VCC) J400.1(VBUS) L401.1
NetD400_1: D400.1(CATHODE) R411.2
NetD401_1: D401.1(CATHODE) R412.2
NetQ400_3: Q400.3(D1) R412.1
NetQ400_6: Q400.6(D2) R411.1

Not connected (* = marked no-connect by the designer): J400 4(ID)*; U400 A2(PA27)* A3(PB04)* A4(PA30)* A7(PC05)* B1(PB00)* B7(PC04)* C1(PB11)* C2(PA31)* C4(PB03)* C6(PB08)* D1(PX12)* D2(PX10)* D3(PX13)* D4(PX16_/_PX53)* D5(PB10)* D7(PB06)* E1(PA02_/_PX47)* E3(PX08)* E4(PX09)* E7(PA16)* E8(PA06_/_PA13)* F3(PX06)* F4(PX07)* G1(PX05)* G2(PX01)* G3(PX02)* G4(PX00)* G6(PA23_/_PX46)* G8(PA00_/_PA18)* G9(PA05)* G10(PA01_/_PA17)* H1(PX04)* H4(PX25)* H5(PX31)* H6(PA22_/_PX20)* H10(PA07_/_PA19)* J1(PX03)* J2(PX24)* J3(PX26)* J7(PA15_/_PX45)* J10(PA24_/_PX17)* K1(PX23)* K5(PC00_/_PX14)* K6(PC01)* K7(PA14_/_PX11)*; XC400 2* 4*

### Layout directives
differential pair; rule Assembly Testpoint Usage [Testpoint - Not Allowed    Multiple - Not Allowed]: EDBG_USB_FS_N, EDBG_USB_FS_P, EDBG_USB_HS_N, EDBG_USB_HS_P
rule Assembly Testpoint Usage [Testpoint - Not Allowed    Multiple - Not Allowed]: XIN0, XOUT0

### Notes on the sheet
- (near TP400) Connect the test points during startup of the EDBG to force it into bootloader mode.
  The test points should be covered with solder so that it is easier to get a good contact.
  The test points should be close together (preferrably on 2.54mm grid).
- (near R420) Current limiter, 10mA @3.3V
- Input filter on USB power input.
- Programming interface of the embedded debugger. The test points will be connected by needles in the test fixture for programming. GND test point is TP400.
- Date:
- PAGE:
- of
- TITLE:
- Document number:
- Revision:

### Library data of the parts
C400 C401 = A01-0019: Ceramic capacitor, SMD 0402, NP0, 50V, +/-5%; PartGroup: Capacitors,Ceramic,SMD 0402; TemperatureRange: -55 - +125 deg C; AN: A01-0019; Value: 22p; Tolerance: 50V, +/-5%; Height: 0,550000011920929
C402 = A01-0015: Ceramic capacitor, SMD 0402, NP0, 50V, +/-5%; PartGroup: Capacitors,Ceramic,SMD 0402; TemperatureRange: -55 - +125 deg C; AN: A01-0015; Value: 10p; Tolerance: 50V, +/-5%; Height: 0,550000011920929
C403 = A01-0046: as C300 on sheet SAMD21_Xplained_Pro_Target_MCU; AN: A01-0046; Tolerance: 25V, +/-10%; Height: 0.550000011920929
C404 C410-C413 = A01-0246: as C301 on sheet SAMD21_Xplained_Pro_Target_MCU; AN: A01-0246; Value: 100n; Tolerance: 16V, +/-10%; Height: 0,5
C405 C409 C414 C415 = A01-0300: Ceramic capacitor, SMD 0402, X5R, 6.3V, +/-20%; PartGroup: Capacitors,Ceramic,SMD 0402; Manufacturer: Kemet; MPN: C0402C225M9PAC; Tolerance: ±20%; TemperatureRange: -55°C to +85°C; AN: A01-0300; Height: 0,5
C406-C408 = A01-0321: Ceramic capacitor, SMD 0402, C0G, 50V, +/-5%; PartGroup: Capacitors,Ceramic,SMD 0402; Manufacturer: Murata; MPN: GRM1555C1H102JA01D; Tolerance: 5%; AN: A01-0321; Value: 1 nF C0G
D400 = A10-0018: LED, Green, Wave length=575nm, SMD 0805, ±70°; PartGroup: Opto,LEDs,SMD; Manufacturer: Everlight; TemperatureRange: -40 - +85 deg C; AN: A10-0018; Height: 1,10000002384186; MPN: EL17-21SYGC
D401 = A10-0019: as D301 on sheet SAMD21_Xplained_Pro_Target_MCU; AN: A10-0019; Height: 1,10000002384186
D402 = A06-0236: as D300 on sheet SAMD21_Xplained_Pro_Target_MCU; AN: A06-0236; Value: PRTR5V0U2X; PartType: Buy; Height: 1,10000002384186; MPN: PRTR5V0U2X
J400 = A08-1368: as J300 on sheet SAMD21_Xplained_Pro_Target_MCU; AN: A08-1368; Height: 2.59999990463257; MPN: 10104111-0001LF
L401 L402 = A03-0035: as L300 on sheet SAMD21_Xplained_Pro_Target_MCU; AN: A03-0035; Value: BLM18PG471SN1; Height: 0,800000011920929; MPN: BLM18PG471SN1
Q400 = A05-0051: Dual N-Channel MOSFET, 60V, 115mA cont,RDS(ON) < 7.5 Ohm @50mA@5V, SOT-363; PartGroup: Transistors,Small signal FET,SMD; Manufacturer: Fairchild; TemperatureRange: -65 to 150 deg C; AN: A05-0051; Height: 1,10000002384186; MPN: 2N7002DW
R401 R402 R409 = A02-0212: Thick film resistor, SMD 0402, 1/16W, 1%; PartGroup: Resistors,SMD,0402 1%; TemperatureRange: -55 - +125 deg C; AN: A02-0212; Tolerance: 1 %; Height: 0.349999994039536
R410 R413 R424 = A02-0284: as R301 on sheet SAMD21_Xplained_Pro_Target_MCU; AN: A02-0284; Tolerance: 1 %
  R410 R413: Height: 0.349999994039536
  R424: Height: 0,349999994039536
R411 R412 R414 R416-R420 = A02-0200: as R303 on sheet SAMD21_Xplained_Pro_Target_MCU; AN: A02-0200; Tolerance: 1 %
  R411 R412: Height: 0.349999994039536
  R414 R416-R420: Height: 0,349999994039536
R421 R422 = A02-0178: as R302 on sheet SAMD21_Xplained_Pro_Target_MCU; AN: A02-0178; Tolerance: 1 %; Height: 0,349999994039536
R423 = A02-0539: Thick film resistor, SMD 0402, 1/16W, 1%; PartGroup: Resistors,SMD,0402 1%; TemperatureRange: -55 - +125 deg C; AN: A02-0539; Tolerance: 1%; Height: 0,349999994039536
R425 = A02-0163: Thick film resistor, SMD 0402, 1/16W, 1%; PartGroup: Resistors,SMD,0402 1%; TemperatureRange: -55 - +125 deg C; AN: A02-0163; Tolerance: 1 %; Height: 0.349999994039536
TP400-TP407 = A08-0004: as TP300 on sheet SAMD21_Xplained_Pro_Target_MCU; AN: A08-0004; Value: TESTPAD; Height: 0
U400 = A06-0736: AVR 32-bit RISC MCU; PartGroup: Integrated Circuits,MCU, MPU, DSP,AVR MCU; Manufacturer: ATMEL; TemperatureRange: -40 to +85 deg C; AN: A06-0736; Height: 1; MPN: AT32UC3A4256J-C1UR
XC400 = A07-0042: Fox FQ5032B 12.0MHz SMD crystal 738B-12; PartGroup: Frequency devices,Crystals,SMD; Manufacturer: Fox  Electronics; MPN: FQ5032B-12-C-C-C-200-1; Tolerance: 30PPM; AN: A07-0042; Value: 12.0MHz; Height: 1,20000004768372

## Sheet SAMD21_Xplained_Pro_Connectors.SchDoc: Extension connectors
size A3; Organization: ATMEL Norway; Address1: Vestre Rosten 79; Address2: N-7075 TILLER; Address3: NORWAY; DocumentNumber: A09-2130; Revision: 2; SheetNumber: 3; SheetTotal: 5; PageSetup: Record=PageOptions|CenterHorizontal=True|CenterVertical=True|PrintScale=1.01|XCorrection=1.00|YCorrection=1.00|PrintKind=1|BorderSize=5000000|LeftOffset=0|BottomOffset=0|Orientation=2|PaperLength=1000|PaperWidth=1000|Scale=100|PaperSource=7|PrintQuality=-4|MediaType=1|DitherType=10|PaperKind=A3 (297 x 420 mm)|PrintScaleMode=1
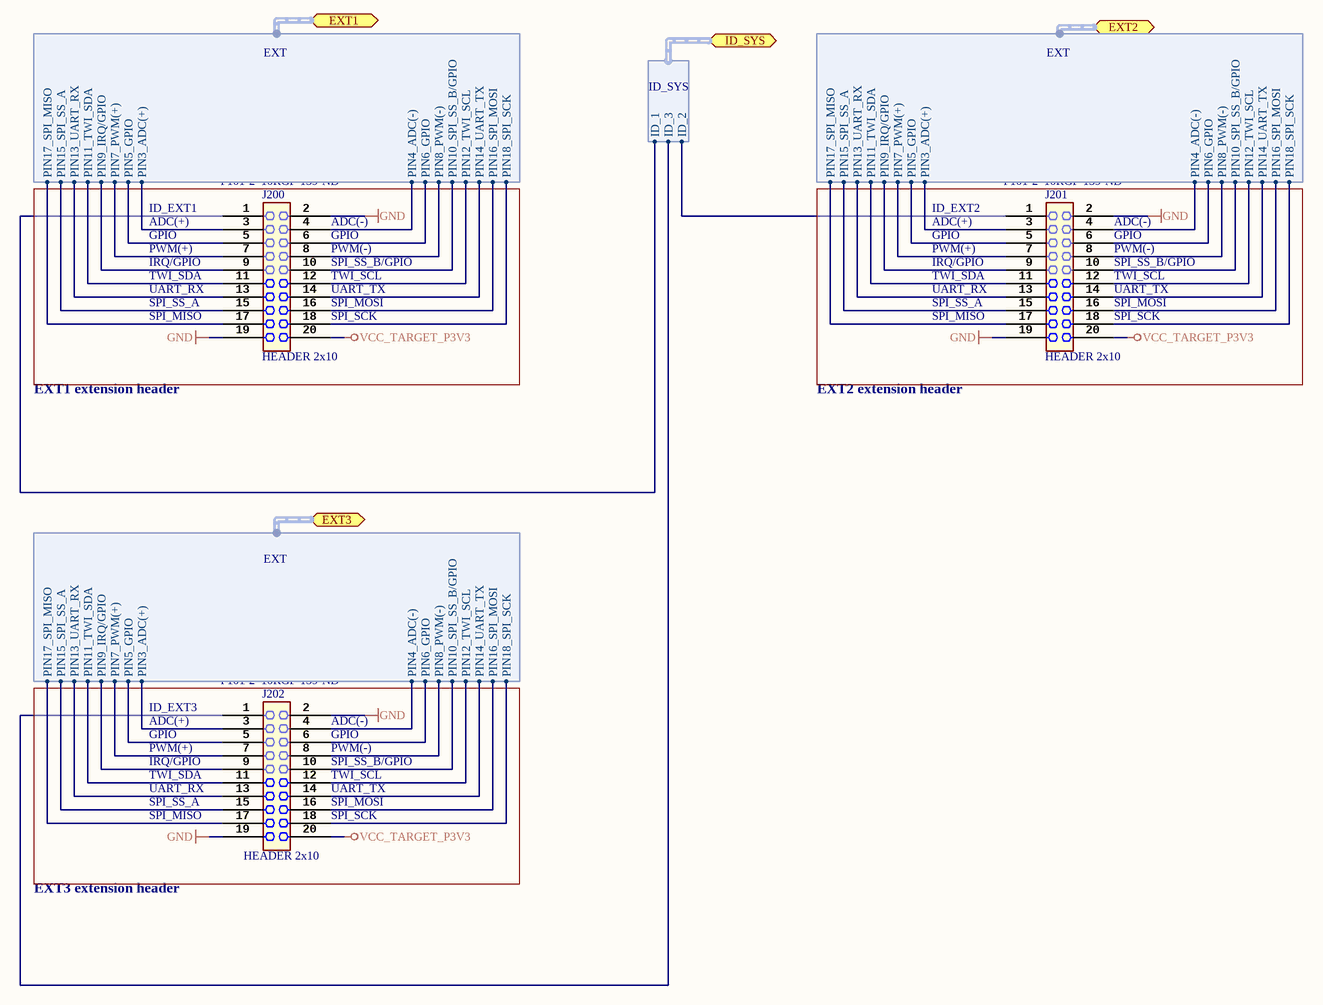
[diagram p3: SAMD21_Xplained_Pro_Connectors.SchDoc]

### Parts
J200  HEADER 2x10  value P101-2*10RGF-139-ND  [AP8-00622]
J201  HEADER 2x10  value P101-2*10RGF-139-ND  [AP8-00622]
J202  HEADER 2x10  value P101-2*10RGF-139-ND  [AP8-00622]

### Ports
EXT1 (harness EXT), EXT2 (harness EXT), EXT3 (harness EXT), ID_SYS (harness ID_SYS)

### Harnesses
ID_SYS: ID_1, ID_2, ID_3
EXT: PIN3_ADC(+), PIN4_ADC(-), PIN5_GPIO, PIN6_GPIO, PIN7_PWM(+), PIN8_PWM(-), PIN9_IRQ/GPIO, PIN10_SPI_SS_B/GPIO, PIN11_TWI_SDA, PIN12_TWI_SCL, PIN13_UART_RX, PIN14_UART_TX, PIN15_SPI_SS_A, PIN16_SPI_MOSI, PIN17_SPI_MISO, PIN18_SPI_SCK

### Nets
GND: J200.2 J200.19 J201.2 J201.19 J202.2 J202.19
VCC_TARGET_P3V3: J200.20 J201.20 J202.20
EDBG_DGI_SCL: J200.12 J201.12 J202.12 ; port EXT1.PIN12_TWI_SCL, port EXT3.PIN12_TWI_SCL, port EXT2.PIN12_TWI_SCL
EDBG_DGI_SDA: J200.11 J201.11 J202.11 ; port EXT1.PIN11_TWI_SDA, port EXT3.PIN11_TWI_SDA, port EXT2.PIN11_TWI_SDA
EDBG_SPI_DGI_MOSI: J202.16 ; port EXT3.PIN16_SPI_MOSI
EDBG_SPI_DGI_SCK: J202.18 ; port EXT3.PIN18_SPI_SCK
ID1: J200.1 ; port ID_SYS.ID_1
ID2: J201.1 ; port ID_SYS.ID_2
ID3: J202.1 ; port ID_SYS.ID_3
PA02_ADC0: J202.3 ; port EXT3.PIN3_ADC(+)
PA03_ADC1: J202.4 ; port EXT3.PIN4_ADC(-)
PA04_S0_SPI_MISO: J200.17 ; port EXT1.PIN17_SPI_MISO
PA05_S0_SPI_SS: J200.15 ; port EXT1.PIN15_SPI_SS_A
PA06_S0_SPI_MOSI: J200.16 ; port EXT1.PIN16_SPI_MOSI
PA07_S0_SPI_SCK: J200.18 ; port EXT1.PIN18_SPI_SCK
PA10_ADC18: J201.3 ; port EXT2.PIN3_ADC(+)
PA11_ADC19: J201.4 ; port EXT2.PIN4_ADC(-)
PA12_PWM_TC2_0: J202.7 ; port EXT3.PIN7_PWM(+)
PA13_PWM_TC2_1: J202.8 ; port EXT3.PIN8_PWM(-)
PA15_GPIO_BTN: J202.6 ; port EXT3.PIN6_GPIO
PA16_S1_SPI_MISO: J201.17 ; port EXT2.PIN17_SPI_MISO
PA17_S1_SPI_SS: J201.15 ; port EXT2.PIN15_SPI_SS_A
PA18_S1_SPI_MOSI: J201.16 ; port EXT2.PIN16_SPI_MOSI
PA19_S1_SPI_SCK: J201.18 ; port EXT2.PIN18_SPI_SCK
PA20_GPIO: J201.5 ; port EXT2.PIN5_GPIO
PA21_GPIO: J201.6 ; port EXT2.PIN6_GPIO
PA27_GPIO_SS: J202.10 ; port EXT3.PIN10_SPI_SS_B/GPIO
PA28_GPIO_IRQ8: J202.9 ; port EXT3.PIN9_IRQ/GPIO
PB00_ADC8: J200.3 ; port EXT1.PIN3_ADC(+)
PB01_ADC9: J200.4 ; port EXT1.PIN4_ADC(-)
PB02_PWM_TC6_0: J200.7 ; port EXT1.PIN7_PWM(+)
PB03_PWM_TC6_1: J200.8 ; port EXT1.PIN8_PWM(-)
PB04_GPIO_IRQ4: J200.9 ; port EXT1.PIN9_IRQ/GPIO
PB05_GPIO_SS: J200.10 ; port EXT1.PIN10_SPI_SS_B/GPIO
PB06_GPIO: J200.5 ; port EXT1.PIN5_GPIO
PB07_GPIO: J200.6 ; port EXT1.PIN6_GPIO
PB08_S4_UART_TX: J200.14 ; port EXT1.PIN14_UART_TX
PB09_S4_UART_RX: J200.13 ; port EXT1.PIN13_UART_RX
PB10_S4_UART_TX: J201.14 J202.14 ; port EXT3.PIN14_UART_TX, port EXT2.PIN14_UART_TX
PB11_S4_UART_RX: J201.13 J202.13 ; port EXT3.PIN13_UART_RX, port EXT2.PIN13_UART_RX
PB12_PWM_TC4_0: J201.7 ; port EXT2.PIN7_PWM(+)
PB13_PWM_TC4_1: J201.8 ; port EXT2.PIN8_PWM(-)
PB14_GPIO_IRQ14: J201.9 ; port EXT2.PIN9_IRQ/GPIO
PB15_GPIO_SS: J201.10 ; port EXT2.PIN10_SPI_SS_B/GPIO
PB16_S5_SPI_MISO: J202.17 ; port EXT3.PIN17_SPI_MISO
PB17_S5_SPI_SS: J202.15 ; port EXT3.PIN15_SPI_SS_A
PB30_GPIO_LED: J202.5 ; port EXT3.PIN5_GPIO

### Notes on the sheet
- ID_EXT1
- ID_EXT2
- ADC(+)
- GPIO
- PWM(+)
- IRQ/GPIO
- TWI_SDA
- UART_RX
- (near J200) ADC(-)
- (near J200) GPIO
- (near J200) PWM(-)
- (near J200) SPI_SS_B/GPIO
- (near J200) TWI_SCL
- (near J200) UART_TX
- (near J201) ADC(-)
- (near J201) GPIO
- (near J201) PWM(-)
- (near J201) SPI_SS_B/GPIO
- (near J201) TWI_SCL
- (near J201) UART_TX
- SPI_SS_A
- SPI_MISO
- (near J200) SPI_MOSI
- (near J200) SPI_SCK
- (near J201) SPI_MOSI
- (near J201) SPI_SCK
- EXT1 extension header
- EXT2 extension header
- ID_EXT3
- (near J202) ADC(-)
- (near J202) GPIO
- (near J202) PWM(-)
- (near J202) SPI_SS_B/GPIO
- (near J202) TWI_SCL
- (near J202) UART_TX
- (near J202) SPI_MOSI
- (near J202) SPI_SCK
- EXT3 extension header
- Date:
- PAGE:
- of
- TITLE:
- Document number:
- Revision:

### Library data of the parts
J200-J202 = A08-1513: Pin header, 2x10, Right Angle, 2.54mm, THM, Pin In Paste; PartGroup: Mechanical devices,Connectors,Pin headers; AN: A08-1513; MPN: P101-2*10RGF-139-ND

## Sheet SAMD21_Xplained_Pro_triple_input_power_supply.SchDoc: Power supply
size A3; Organization: ATMEL Norway; Address1: Vestre Rosten 79; Address2: N-7075 TILLER; Address3: NORWAY; DocumentNumber: A09-2130; Revision: 2; SheetNumber: 2; SheetTotal: 5; PageSetup: Record=PageOptions|CenterHorizontal=True|CenterVertical=True|PrintScale=1.01|XCorrection=1.00|YCorrection=1.00|PrintKind=1|BorderSize=5000000|LeftOffset=0|BottomOffset=0|Orientation=2|PaperLength=1000|PaperWidth=1000|Scale=100|PaperSource=7|PrintQuality=-4|MediaType=1|DitherType=10|PaperKind=A3 (297 x 420 mm)|PrintScaleMode=1
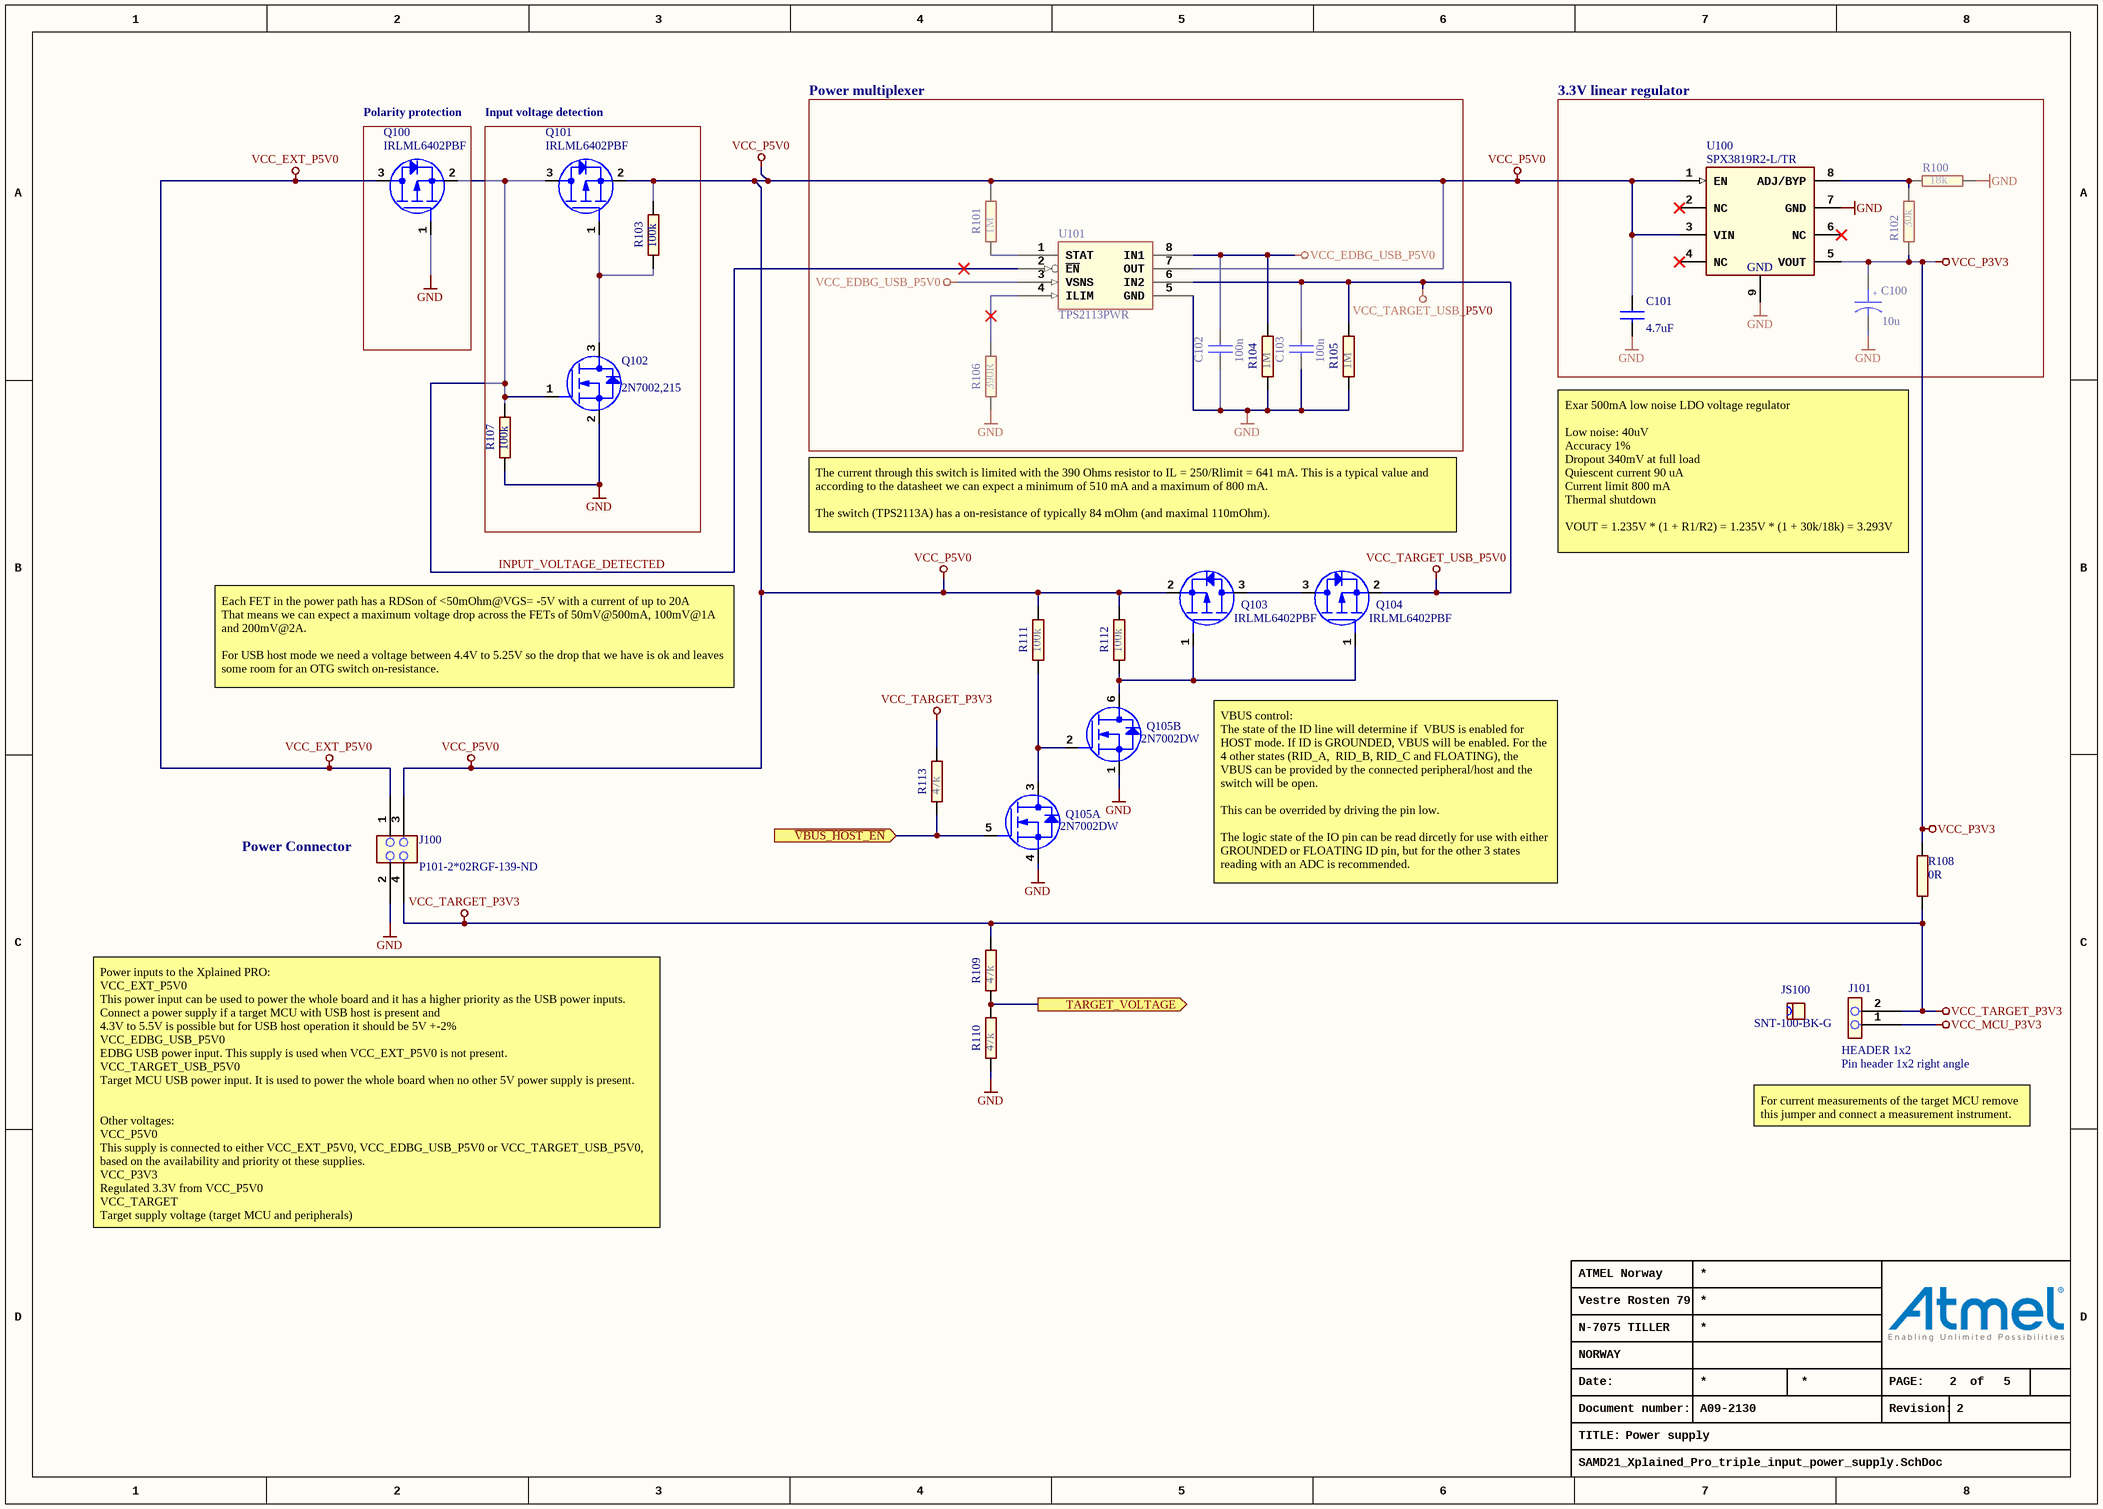
[diagram p4: SAMD21_Xplained_Pro_triple_input_power_supply.SchDoc]

### Parts
C100  value 10u  [AP1-00036]  (hidden comment: CAP-POL)
C101  value 4.7uF  [AP1-00039]  (hidden comment: CAP-NONPOL)
C102  value 100n  [AP1-00001]  (hidden comment: CAP-NONPOL)
C103  value 100n  [AP1-00001]  (hidden comment: CAP-NONPOL)
J100  value P101-2*02RGF-139-ND  [AP8-00628]  (hidden comment: HEADER 2x2)
J101  HEADER 1x2  value Pin header 1x2 right angle  [AP8-00367]
JS100  value SNT-100-BK-G  [AP8-00525]
Q100  value IRLML6402PBF  [AP5-00002]  (hidden comment: MOSFET_P_GSD)
Q101  value IRLML6402PBF  [AP5-00002]  (hidden comment: MOSFET_P_GSD)
Q102  value 2N7002,215  [AP5-00002]  (hidden comment: MOSFET_N_GSD)
Q103  value IRLML6402PBF  [AP5-00002]  (hidden comment: MOSFET_P_GSD)
Q104  value IRLML6402PBF  [AP5-00002]  (hidden comment: MOSFET_P_GSD)
Q105  value 2N7002DW  [AP5-00001]  (hidden comment: Same as 2N7002 but with two MOSFETs in one package)  (parts A,B of 2)
R100  value 18k  [AP2-00000]  (hidden comment: R2)
R101  value 1M  [AP2-00000]  (hidden comment: R2)
R102  value 30k  [AP2-00000]  (hidden comment: R2)
R103  value 100k  [AP2-00000]  (hidden comment: R2)
R104  value 1M  [AP2-00000]  (hidden comment: R2)
R105  value 1M  [AP2-00000]  (hidden comment: R2)
R106  value 390R  [AP2-00000]  (hidden comment: R2)
R107  value 100k  [AP2-00000]  (hidden comment: R2)
R108  value 0R  [AP2-00000]  (hidden comment: R2)
R109  value 47k  [AP2-00000]  (hidden comment: R2)
R110  value 47k  [AP2-00000]  (hidden comment: R2)
R111  value 100k  [AP2-00000]  (hidden comment: R2)
R112  value 100k  [AP2-00000]  (hidden comment: R2)
R113  value 47k  [AP2-00000]  (hidden comment: R2)
U100  value SPX3819R2-L/TR  [AP6-00338]  (hidden comment: Mouser: 1016-1588-2-ND)
U101  value TPS2113PWR  [AP6-00054]  (hidden comment: TPS2112)

### Blocks framed on the sheet
Polarity protection: Q100
Input voltage detection: Q101 Q102 R103 R107
Power multiplexer: C102 C103 R101 R104-R106 U101
3.3V linear regulator: C100 C101 R100 R102 U100

### Ports
TARGET_VOLTAGE (out), ~{VBUS_HOST_EN} (in)

### Nets
GND: C100.2 C101.2 C102.2 C103.2 J100.2 Q100.1(G) Q102.2(S) Q105.1(S2) Q105.4(S1) R100.2 R104.1 R105.1 R106.1 R107.1 R110.1 U100.7(GND) U100.9(GND) U101.5(GND)
VCC_EDBG_USB_P5V0: C102.1 R104.2 U101.3(VSNS) U101.8(IN1)
VCC_EXT_P5V0: J100.1 Q100.3(D)
VCC_MCU_P3V3: J101.1
VCC_P3V3: C100.1 R102.1 R108.1 U100.5(VOUT)
VCC_P5V0: C101.1 J100.3 Q101.2(S) Q103.2(S) R101.2 R103.2 R111.2 R112.1 U100.1(EN) U100.3(VIN) U101.7(OUT)
VCC_TARGET_P3V3: J100.4 J101.2 R108.2 R109.2 R113.2
VCC_TARGET_USB_P5V0: C103.1 Q104.2(S) R105.2 U101.6(IN2)
EDBG_ADC0: R109.1 R110.2 ; port TARGET_VOLTAGE
INPUT_VOLTAGE_DETECTED: Q100.2(S) Q101.3(D) Q102.1(G) R107.2 U101.2(~{EN})
TARGET_USB_ID: Q105.5(G1) R113.1 ; port ~{VBUS_HOST_EN}
NetQ101_1: Q101.1(G) Q102.3(D) R103.1
NetQ103_1: Q103.1(G) Q104.1(G) Q105.6(D2) R112.2
NetQ103_3: Q103.3(D) Q104.3(D)
NetQ105_2: Q105.2(G2) Q105.3(D1) R111.1
NetR100_1: R100.1 R102.2 U100.8(ADJ/BYP)
NetR101_1: R101.1 U101.1(STAT)
NetR106_2: R106.2 U101.4(ILIM)

Not connected (* = marked no-connect by the designer): U100 2(NC)* 4(NC)* 6(NC)*

### Notes on the sheet
- The current through this switch is limited with the 390 Ohms resistor to IL = 250/Rlimit = 641 mA. This is a typical value and according to the datasheet we can expect a minimum of 510 mA and a maximum of 800 mA.
  The switch (TPS2113A) has a on-resistance of typically 84 mOhm (and maximal 110mOhm).
- Exar 500mA low noise LDO voltage regulator
  Low noise: 40uV
  Accuracy 1%
  Dropout 340mV at full load
  Quiescent current 90 uA
  Current limit 800 mA
  Thermal shutdown
  VOUT = 1.235V * (1 + R1/R2) = 1.235V * (1 + 30k/18k) = 3.293V
- Each FET in the power path has a RDSon of <50mOhm@VGS= -5V with a current of up to 20A
  That means we can expect a maximum voltage drop across the FETs of 50mV@500mA, 100mV@1A and 200mV@2A.
  For USB host mode we need a voltage between 4.4V to 5.25V so the drop that we have is ok and leaves some room for an OTG switch on-resistance.
- (near J100) Power Connector
- VBUS control:
  The state of the ID line will determine if  VBUS is enabled for HOST mode. If ID is GROUNDED, VBUS will be enabled. For the 4 other states (RID_A,  RID_B, RID_C and FLOATING), the VBUS can be provided by the connected peripheral/host and the switch will be open.
  This can be overrided by driving the pin low.
  The logic state of the IO pin can be read dircetly for use with either GROUNDED or FLOATING ID pin, but for the other 3 states reading with an ADC is recommended.
- For current measurements of the target MCU remove this jumper and connect a measurement instrument.
- Power inputs to the Xplained PRO:
  VCC_EXT_P5V0
  This power input can be used to power the whole board and it has a higher priority as the USB power inputs. Connect a power supply if a target MCU with USB host is present and
  4.3V to 5.5V is possible but for USB host operation it should be 5V +-2%
  VCC_EDBG_USB_P5V0
  EDBG USB power input. This supply is used when VCC_EXT_P5V0 is not present.
  VCC_TARGET_USB_P5V0
  Target MCU USB power input. It is used to power the whole board when no other 5V power supply is present.
  Other voltages:
  VCC_P5V0
  This supply is connected to either VCC_EXT_P5V0, VCC_EDBG_USB_P5V0 or VCC_TARGET_USB_P5V0, based on the availability and priority ot these supplies.
  VCC_P3V3
  Regulated 3.3V from VCC_P5V0
  VCC_TARGET
  Target supply voltage (target MCU and peripherals)
- Date:
- PAGE:
- of
- TITLE:
- Document number:
- Revision:
- (in symbol A01-0324) +

### Library data of the parts
C100 = A01-0324: SMD tantalum capacitor, ESR = 1.7, 3216-18 (EIA) 1206,; PartGroup: Capacitors,Tantalum; Manufacturer: vishay; MPN: TR3A106K016C1700; Tolerance: +-10%; TemperatureRange: -55°C ~ 85°C; AN: A01-0324; Height: 1.60000002384186
C101 = A01-0377: Ceramic capacitor, SMD 0603, X5R, 10V, 10% (de31036); PartGroup: Capacitors,Ceramic,SMD 0603; Manufacturer: tdk; MPN: C1608X5R1A475K; TemperatureRange: -55 - +85 deg C; AN: A01-0377; Tolerance: 10%; Height: 0.800000011920929
C102 C103 = A01-0246: as C301 on sheet SAMD21_Xplained_Pro_Target_MCU; AN: A01-0246; Tolerance: 16V, +/-10%; Height: 0.5
J100 = A08-1519: Pin header, 2x2, Right Angle, 2.54mm, THT, Pin In Paste; PartGroup: Mechanical devices,Connectors,Pin headers; AN: A08-1519; Height: 5.07999992370605; MPN: P101-2*02RGF-139-ND
J101 = A08-0764: 1x2 pin header, right angle, 2.54 mm pitch, through-hole; PartGroup: Mechanical devices,Connectors,Pin headers; Manufacturer: Pro-data International Corp; MPN: 2213R-2G; AN: A08-0764; Height: 2.53999996185303
JS100 = A08-0543: as JS300 on sheet SAMD21_Xplained_Pro_Target_MCU; AN: A08-0543; MPN: SNT-100-BK-G
Q100 Q101 Q103 Q104 = A05-0087: P-ch. MOSFET. -30V, -3.7A continuous,RDS(ON)=0.05Ohm@VGS=-4,5V, RDS(ON)=0.08Ohm@VGS=-2.5V; PartGroup: Transistors,Power FET,SMD; Manufacturer: International Rectifier; TemperatureRange: -55 - +150 deg C; AN: A05-0087; Height: 1.14999997615814; MPN: IRLML6402PBF
Q102 = A05-0085: N-Channel MOSFET. 60V, 0.300A continuous, 1.2A Peak. RDS(ON) = 3.8Ohm@VGS=4.5V, VGS(th)<2.5V; PartGroup: Transistors,Small signal FET,SMD; Manufacturer: NXP; TemperatureRange: -65 to 150 deg C; AN: A05-0085; Height: 1.10000002384186; MPN: 2N7002,215
Q105 = A05-0051: as Q400 on sheet SAMD21_Xplained_Pro_EDBG; AN: A05-0051; Height: 1,10000002384186; MPN: 2N7002DW
R100 = A02-0242: Thick film resistor, SMD 0402, 1/16W, 1%; PartGroup: Resistors,SMD,0402 1%; TemperatureRange: -55 - +125 deg C; AN: A02-0242; Tolerance: 1 %; Height: 0.349999994039536
R101 R104 R105 = A02-0284: Thick film resistor, SMD 0402, 1/16W, 1%; PartGroup: Resistors,SMD,0402 1%; TemperatureRange: -55 - +125 deg C; AN: A02-0284; Tolerance: 1 %; Height: 0.349999994039536
R102 = A02-0247: as R307 on sheet SAMD21_Xplained_Pro_Target_MCU; AN: A02-0247; Tolerance: 1 %; Height: 0.349999994039536
R103 R107 = A02-0260: as R300 on sheet SAMD21_Xplained_Pro_Target_MCU; AN: A02-0260; Tolerance: 1 %; Height: 0.349999994039536
R106 = A02-0202: Thick film resistor, SMD 0402, 1/16W, 1%; PartGroup: Resistors,SMD,0402 1%; TemperatureRange: -55 - +125 deg C; AN: A02-0202; Tolerance: 1 %; Height: 0.349999994039536
R108 = A02-0163: as R425 on sheet SAMD21_Xplained_Pro_EDBG; AN: A02-0163; Tolerance: 1 %; Height: 0.349999994039536
R109 R110 R113 = A02-0252: as R308 on sheet SAMD21_Xplained_Pro_Target_MCU; AN: A02-0252; Tolerance: 1 %; Height: 0.349999994039536
R111 R112 = A02-0260: Thick film resistor, SMD 0402, 1/16W, 1%; PartGroup: Resistors,SMD,0402 1%; TemperatureRange: -55ï¿½ to +125ï¿½C; AN: A02-0260; Tolerance: 1 %; Height: 0.349999994039536
U100 = A06-0957: 500mA LDO, ADJ, low noise, 8-DFN package; PartGroup: Integrated Circuits,Regulators,Linear; Manufacturer: Exar; Tolerance: ±1%; TemperatureRange: -40°C to +125°C; AN: A06-0957; Height: 0.899999976158142; MPN: SPX3819R2-L/TR
U101 = A06-0068: Autoswitching 2:1 Power Mux; PartGroup: Integrated Circuits,General linear,Analog switch, bus switch and MUX; Manufacturer: Texas Instruments; TemperatureRange: -40 - + 125 deg C; AN: A06-0068; Height: 1.20000004768372; MPN: TPS2113PWR